# Altium project UCLA-DRS4.PrjPCB (part 9 of 10)

## Sheet DRS4_GPIO_EXPANDER.SchDoc: My title
size A3; Organization: University of California; Address1: 475 Portola Plaza; Address2: Los Angeles, CA 90095; DocumentNumber: 33; Revision: R01; SheetNumber: 33; SheetTotal: 35
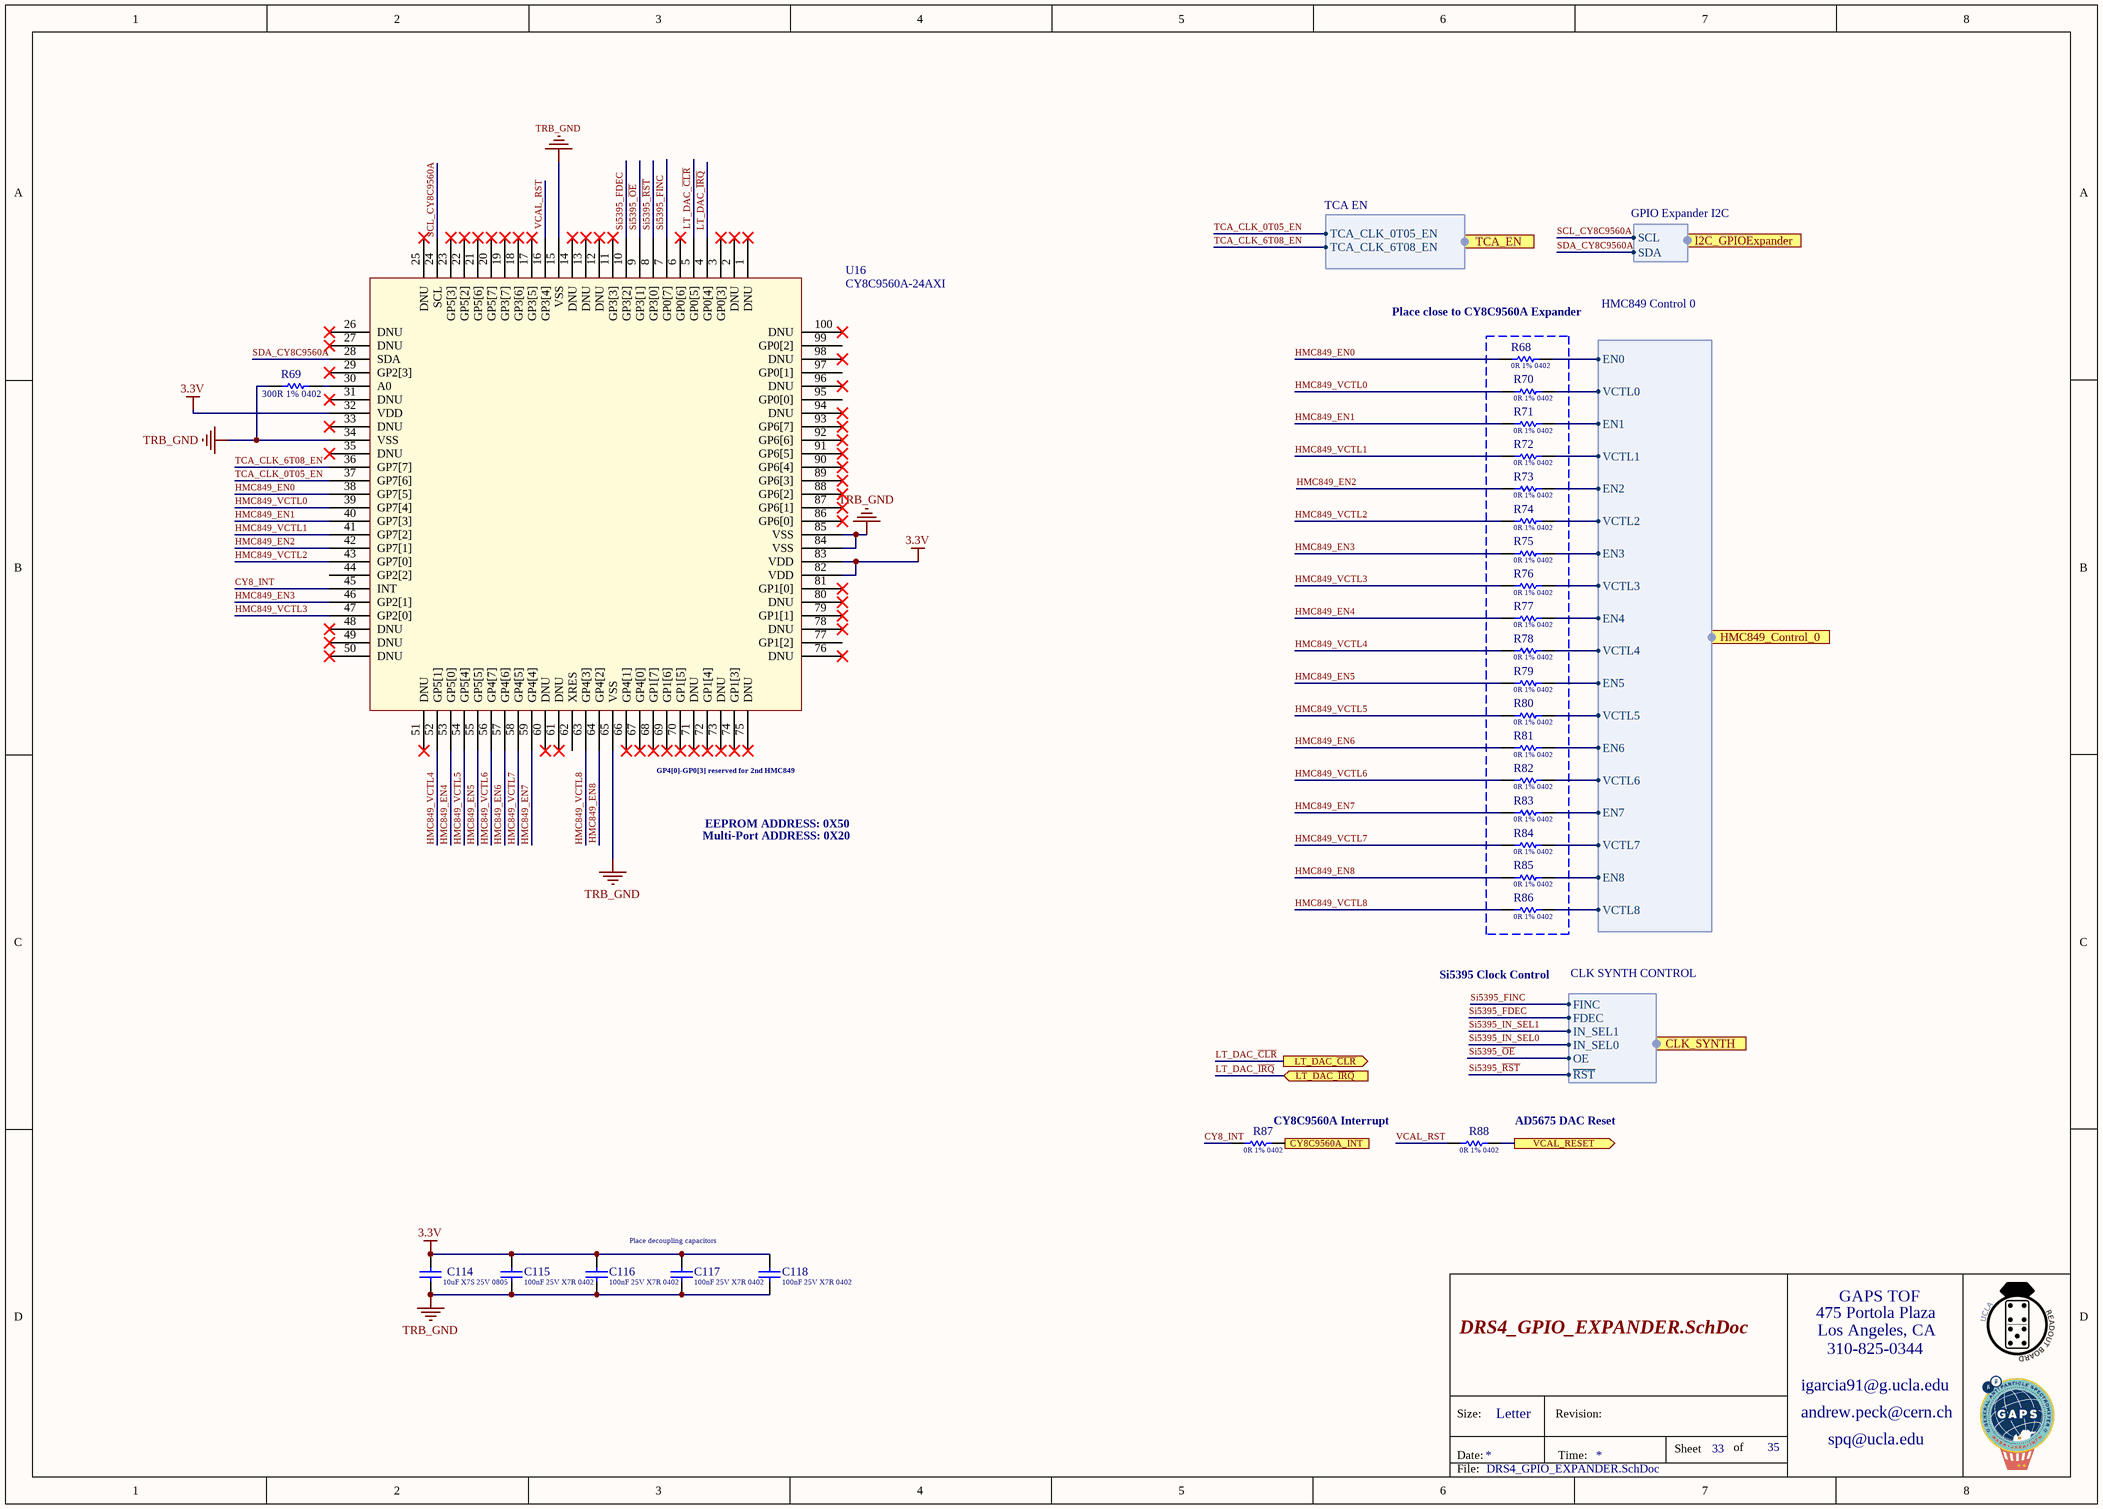
[diagram p27: DRS4_GPIO_EXPANDER.SchDoc]

### Parts
C114  Capacitance: 10uF X7S 25V 0805  [Cap_Murata_ GRM21BC71E106ME11L_10uF]  (hidden comment: Cap_Murata_ GRM21BC71E106ME11L_10uF)
C115  Capacitance: 100nF 25V X7R 0402  [Cap_Taiyo_Yuden_TMK105B7104KV-FR_100nF]  (hidden comment: Cap_Taiyo_Yuden_TMK105B7104KV-FR_100nF)
C116  Capacitance: 100nF 25V X7R 0402  [Cap_Taiyo_Yuden_TMK105B7104KV-FR_100nF]  (hidden comment: Cap_Taiyo_Yuden_TMK105B7104KV-FR_100nF)
C117  Capacitance: 100nF 25V X7R 0402  [Cap_Taiyo_Yuden_TMK105B7104KV-FR_100nF]  (hidden comment: Cap_Taiyo_Yuden_TMK105B7104KV-FR_100nF)
C118  Capacitance: 100nF 25V X7R 0402  [Cap_Taiyo_Yuden_TMK105B7104KV-FR_100nF]  (hidden comment: Cap_Taiyo_Yuden_TMK105B7104KV-FR_100nF)
R68  Resistance: 0R 1% 0402  [Res_Vishay_CRCW04020000Z0EDC_0_Ohm]  (hidden comment: Res_Vishay_CRCW04020000Z0EDC_0_Ohm)
R69  300R 1% 0402  [RESC0402(1005)_L]
R70  Resistance: 0R 1% 0402  [Res_Vishay_CRCW04020000Z0EDC_0_Ohm]  (hidden comment: Res_Vishay_CRCW04020000Z0EDC_0_Ohm)
R71  Resistance: 0R 1% 0402  [Res_Vishay_CRCW04020000Z0EDC_0_Ohm]  (hidden comment: Res_Vishay_CRCW04020000Z0EDC_0_Ohm)
R72  Resistance: 0R 1% 0402  [Res_Vishay_CRCW04020000Z0EDC_0_Ohm]  (hidden comment: Res_Vishay_CRCW04020000Z0EDC_0_Ohm)
R73  Resistance: 0R 1% 0402  [Res_Vishay_CRCW04020000Z0EDC_0_Ohm]  (hidden comment: Res_Vishay_CRCW04020000Z0EDC_0_Ohm)
R74  Resistance: 0R 1% 0402  [Res_Vishay_CRCW04020000Z0EDC_0_Ohm]  (hidden comment: Res_Vishay_CRCW04020000Z0EDC_0_Ohm)
R75  Resistance: 0R 1% 0402  [Res_Vishay_CRCW04020000Z0EDC_0_Ohm]  (hidden comment: Res_Vishay_CRCW04020000Z0EDC_0_Ohm)
R76  Resistance: 0R 1% 0402  [Res_Vishay_CRCW04020000Z0EDC_0_Ohm]  (hidden comment: Res_Vishay_CRCW04020000Z0EDC_0_Ohm)
R77  Resistance: 0R 1% 0402  [Res_Vishay_CRCW04020000Z0EDC_0_Ohm]  (hidden comment: Res_Vishay_CRCW04020000Z0EDC_0_Ohm)
R78  Resistance: 0R 1% 0402  [Res_Vishay_CRCW04020000Z0EDC_0_Ohm]  (hidden comment: Res_Vishay_CRCW04020000Z0EDC_0_Ohm)
R79  Resistance: 0R 1% 0402  [Res_Vishay_CRCW04020000Z0EDC_0_Ohm]  (hidden comment: Res_Vishay_CRCW04020000Z0EDC_0_Ohm)
R80  Resistance: 0R 1% 0402  [Res_Vishay_CRCW04020000Z0EDC_0_Ohm]  (hidden comment: Res_Vishay_CRCW04020000Z0EDC_0_Ohm)
R81  Resistance: 0R 1% 0402  [Res_Vishay_CRCW04020000Z0EDC_0_Ohm]  (hidden comment: Res_Vishay_CRCW04020000Z0EDC_0_Ohm)
R82  Resistance: 0R 1% 0402  [Res_Vishay_CRCW04020000Z0EDC_0_Ohm]  (hidden comment: Res_Vishay_CRCW04020000Z0EDC_0_Ohm)
R83  Resistance: 0R 1% 0402  [Res_Vishay_CRCW04020000Z0EDC_0_Ohm]  (hidden comment: Res_Vishay_CRCW04020000Z0EDC_0_Ohm)
R84  Resistance: 0R 1% 0402  [Res_Vishay_CRCW04020000Z0EDC_0_Ohm]  (hidden comment: Res_Vishay_CRCW04020000Z0EDC_0_Ohm)
R85  Resistance: 0R 1% 0402  [Res_Vishay_CRCW04020000Z0EDC_0_Ohm]  (hidden comment: Res_Vishay_CRCW04020000Z0EDC_0_Ohm)
R86  Resistance: 0R 1% 0402  [Res_Vishay_CRCW04020000Z0EDC_0_Ohm]  (hidden comment: Res_Vishay_CRCW04020000Z0EDC_0_Ohm)
R87  Resistance: 0R 1% 0402  [Res_Vishay_CRCW04020000Z0EDC_0_Ohm]  (hidden comment: Res_Vishay_CRCW04020000Z0EDC_0_Ohm)
R88  Resistance: 0R 1% 0402  [Res_Vishay_CRCW04020000Z0EDC_0_Ohm]  (hidden comment: Res_Vishay_CRCW04020000Z0EDC_0_Ohm)
U16  Series: CY8C9560A-24AXI  [IC_Cypress_Semiconductor_CY8C9560A-24AXI]  (hidden comment: IC_Cypress_Semiconductor_CY8C9560A-24AXI)

### Ports
CLK_SYNTH (harness CLK SYNTH CONTROL), CY8C9560A_INT (out), HMC849_Control_0 (harness HMC849 Control 0), I2C_GPIOExpander (harness GPIO Expander I2C), LT_DAC_~{CLR} (out), LT_DAC_~{IRQ} (in), TCA_EN (harness TCA EN), VCAL_RESET (out)

### Harnesses
HMC849 Control 0: EN0, VCTL0, EN1, VCTL1, EN2, VCTL2, EN3, VCTL3, EN4, VCTL4, EN5, VCTL5, EN6, VCTL6, EN7, VCTL7, EN8, VCTL8
GPIO Expander I2C: SCL, SDA
TCA EN: TCA_CLK_0T05_EN, TCA_CLK_6T08_EN
CLK SYNTH CONTROL: ~{RST}, OE, IN_SEL0, IN_SEL1, FDEC, FINC

### Nets
3.3V: C114.1 C115.2 C116.2 C117.2 C118.2 U16.32(VDD) U16.82(VDD) U16.83(VDD)
TRB_GND: C114.2 C115.1 C116.1 C117.1 C118.1 R69.2 U16.15(VSS) U16.34(VSS) U16.65(VSS) U16.84(VSS) U16.85(VSS)
CY8_INT: R87.2 U16.45(INT)
HMC849:EN0: R68.2 ; port HMC849_Control_0.EN0
HMC849:EN1: R71.2 ; port HMC849_Control_0.EN1
HMC849:EN2: R73.2 ; port HMC849_Control_0.EN2
HMC849:EN3: R75.2 ; port HMC849_Control_0.EN3
HMC849:EN4: R77.2 ; port HMC849_Control_0.EN4
HMC849:EN5: R79.2 ; port HMC849_Control_0.EN5
HMC849:EN6: R81.2 ; port HMC849_Control_0.EN6
HMC849:EN7: R83.2 ; port HMC849_Control_0.EN7
HMC849:EN8: R85.2 ; port HMC849_Control_0.EN8
HMC849:VCTL0: R70.2 ; port HMC849_Control_0.VCTL0
HMC849:VCTL1: R72.2 ; port HMC849_Control_0.VCTL1
HMC849:VCTL2: R74.2 ; port HMC849_Control_0.VCTL2
HMC849:VCTL3: R76.2 ; port HMC849_Control_0.VCTL3
HMC849:VCTL4: R78.2 ; port HMC849_Control_0.VCTL4
HMC849:VCTL5: R80.2 ; port HMC849_Control_0.VCTL5
HMC849:VCTL6: R82.2 ; port HMC849_Control_0.VCTL6
HMC849:VCTL7: R84.2 ; port HMC849_Control_0.VCTL7
HMC849:VCTL8: R86.2 ; port HMC849_Control_0.VCTL8
HMC849_EN0: R68.1 U16.38(GP7[5])
HMC849_EN1: R71.1 U16.40(GP7[3])
HMC849_EN2: R73.1 U16.42(GP7[1])
HMC849_EN3: R75.1 U16.46(GP2[1])
HMC849_EN4: R77.1 U16.53(GP5[0])
HMC849_EN5: R79.1 U16.55(GP5[5])
HMC849_EN6: R81.1 U16.57(GP4[6])
HMC849_EN7: R83.1 U16.59(GP4[4])
HMC849_EN8: R85.1 U16.64(GP4[2])
HMC849_VCTL0: R70.1 U16.39(GP7[4])
HMC849_VCTL1: R72.1 U16.41(GP7[2])
HMC849_VCTL2: R74.1 U16.43(GP7[0])
HMC849_VCTL3: R76.1 U16.47(GP2[0])
HMC849_VCTL4: R78.1 U16.52(GP5[1])
HMC849_VCTL5: R80.1 U16.54(GP5[4])
HMC849_VCTL6: R82.1 U16.56(GP4[7])
HMC849_VCTL7: R84.1 U16.58(GP4[5])
HMC849_VCTL8: R86.1 U16.63(GP4[3])
IO_B35_L15_AD12_F20_N: R87.1 ; port CY8C9560A_INT
LT_DAC_~{CLR}: U16.5(GP0[5]) ; port LT_DAC_~{CLR}  [project net DAC_~{CLR}]
LT_DAC_~{IRQ}: U16.4(GP0[4]) ; port LT_DAC_~{IRQ}  [project net DAC_~{IRQ}]
SCL_CY8C9560A: U16.24(SCL) ; port I2C_GPIOExpander.SCL
SDA_CY8C9560A: U16.28(SDA) ; port I2C_GPIOExpander.SDA
Si5395_FDEC: U16.10(GP3[2]) ; port CLK_SYNTH.FDEC
Si5395_FINC: U16.7(GP0[7]) ; port CLK_SYNTH.FINC
Si5395_IN_SEL0: port CLK_SYNTH.IN_SEL0
Si5395_IN_SEL1: port CLK_SYNTH.IN_SEL1
Si5395_~{OE}: U16.9(GP3[1]) ; port CLK_SYNTH.OE
Si5395_~{RST}: U16.8(GP3[0]) ; port CLK_SYNTH.~{RST}
TCA_CLK_0T05_EN: U16.37(GP7[6]) ; port TCA_EN.TCA_CLK_0T05_EN
TCA_CLK_6T08_EN: U16.36(GP7[7]) ; port TCA_EN.TCA_CLK_6T08_EN
VCAL_RESET: R88.1 ; port VCAL_RESET
VCAL_RST: R88.2 U16.16(GP3[4])
NetR69_1: R69.1 U16.30(A0)

Not connected (* = marked no-connect by the designer): U16 1(DNU)* 2(DNU)* 3(GP0[3])* 6(GP0[6])* 11(GP3[3])* 12(DNU)* 13(DNU)* 14(DNU)* 17(GP3[5])* 18(GP3[6])* 19(GP3[7])* 20(GP5[7])* 21(GP5[6])* 22(GP5[2])* 23(GP5[3])* 25(DNU)* 26(DNU)* 27(DNU)* 29(GP2[3])* 31(DNU)* 33(DNU)* 35(DNU)* 44(GP2[2]) 48(DNU)* 49(DNU)* 50(DNU)* 51(DNU)* 60(DNU)* 61(DNU)* 62(XRES) 66(GP4[1])* 67(GP4[0])* 68(GP1[7])* 69(GP1[6])* 70(GP1[5])* 71(DNU)* 72(GP1[4])* 73(DNU)* 74(GP1[3])* 75(DNU)* 76(DNU)* 77(GP1[2]) 78(DNU)* 79(GP1[1])* 80(DNU)* 81(GP1[0])* 86(GP6[0])* 87(GP6[1])* 88(GP6[2])* 89(GP6[3])* 90(GP6[4])* 91(GP6[5])* 92(GP6[6])* 93(GP6[7])* 94(DNU)* 95(GP0[0]) 96(DNU)* 97(GP0[1]) 98(DNU)* 99(GP0[2]) 100(DNU)*

### Notes on the sheet
- (near R68) Place close to CY8C9560A Expander
- GP4[0]-GP0[3] reserved for 2nd HMC849
- Multi-Port ADDRESS: 0X20
- EEPROM ADDRESS: 0X50
- Si5395 Clock Control
- (near R87) CY8C9560A Interrupt
- (near R88) AD5675 DAC Reset
- (near C117) Place decoupling capacitors
- 475 Portola Plaza
- GAPS TOF
- igarcia91@g.ucla.edu
- Los Angeles, CA
- 310-825-0344
- Size:
- Date:
- Letter
- Revision:
- Time:
- Sheet
- of
- andrew.peck@cern.ch
- spq@ucla.edu
- File:

### Library data of the parts
C114 = Cap_Murata_ GRM21BC71E106ME11L_10uF: CAP CER 10uF 25V X7R 0805; Supplier 1: Mouser; Supplier Part Number 1: 81-GRM21BC71E106ME1L
C115-C118 = Cap_Taiyo_Yuden_TMK105B7104KV-FR_100nF: CAP CER 100nF 25V X7R 0402; Supplier 1: Mouser; Supplier Part Number 1: 963-TMK105B7104KV-FR
R68 R70-R88 = Res_Vishay_CRCW04020000Z0EDC_0_Ohm: 0R 0.062W 1% 0402 (1005 Metric)  SMD; Supplier 1: Mouser; Supplier Part Number 1: 71-CRCW04020000Z0EDC
R69 = CMP-1011-00449-1: 300R 0.063W 1% 0402 (1005 Metric)  SMD; Case-EIA: 0402; Value: 300.00 Ohm; Case-Metric: 1005; Tolerance: 1 %; Technology: SMT; Power: 0.063 W
U16 = IC_Cypress_Semiconductor_CY8C9560A-24AXI: Interface - I/O Expanders 60BIT IO EXPANDER W/EEPROM; Supplier 1: Mouser; Supplier Part Number 1: 727-CY8C9560A-24AXI

## Sheet GPIO_EXPANDER_LED.SchDoc: My title
size A3; Organization: University of California; Address1: 475 Portola Plaza; Address2: Los Angeles, CA 90095; DocumentNumber: 32; Revision: R01; SheetNumber: 32; SheetTotal: 35
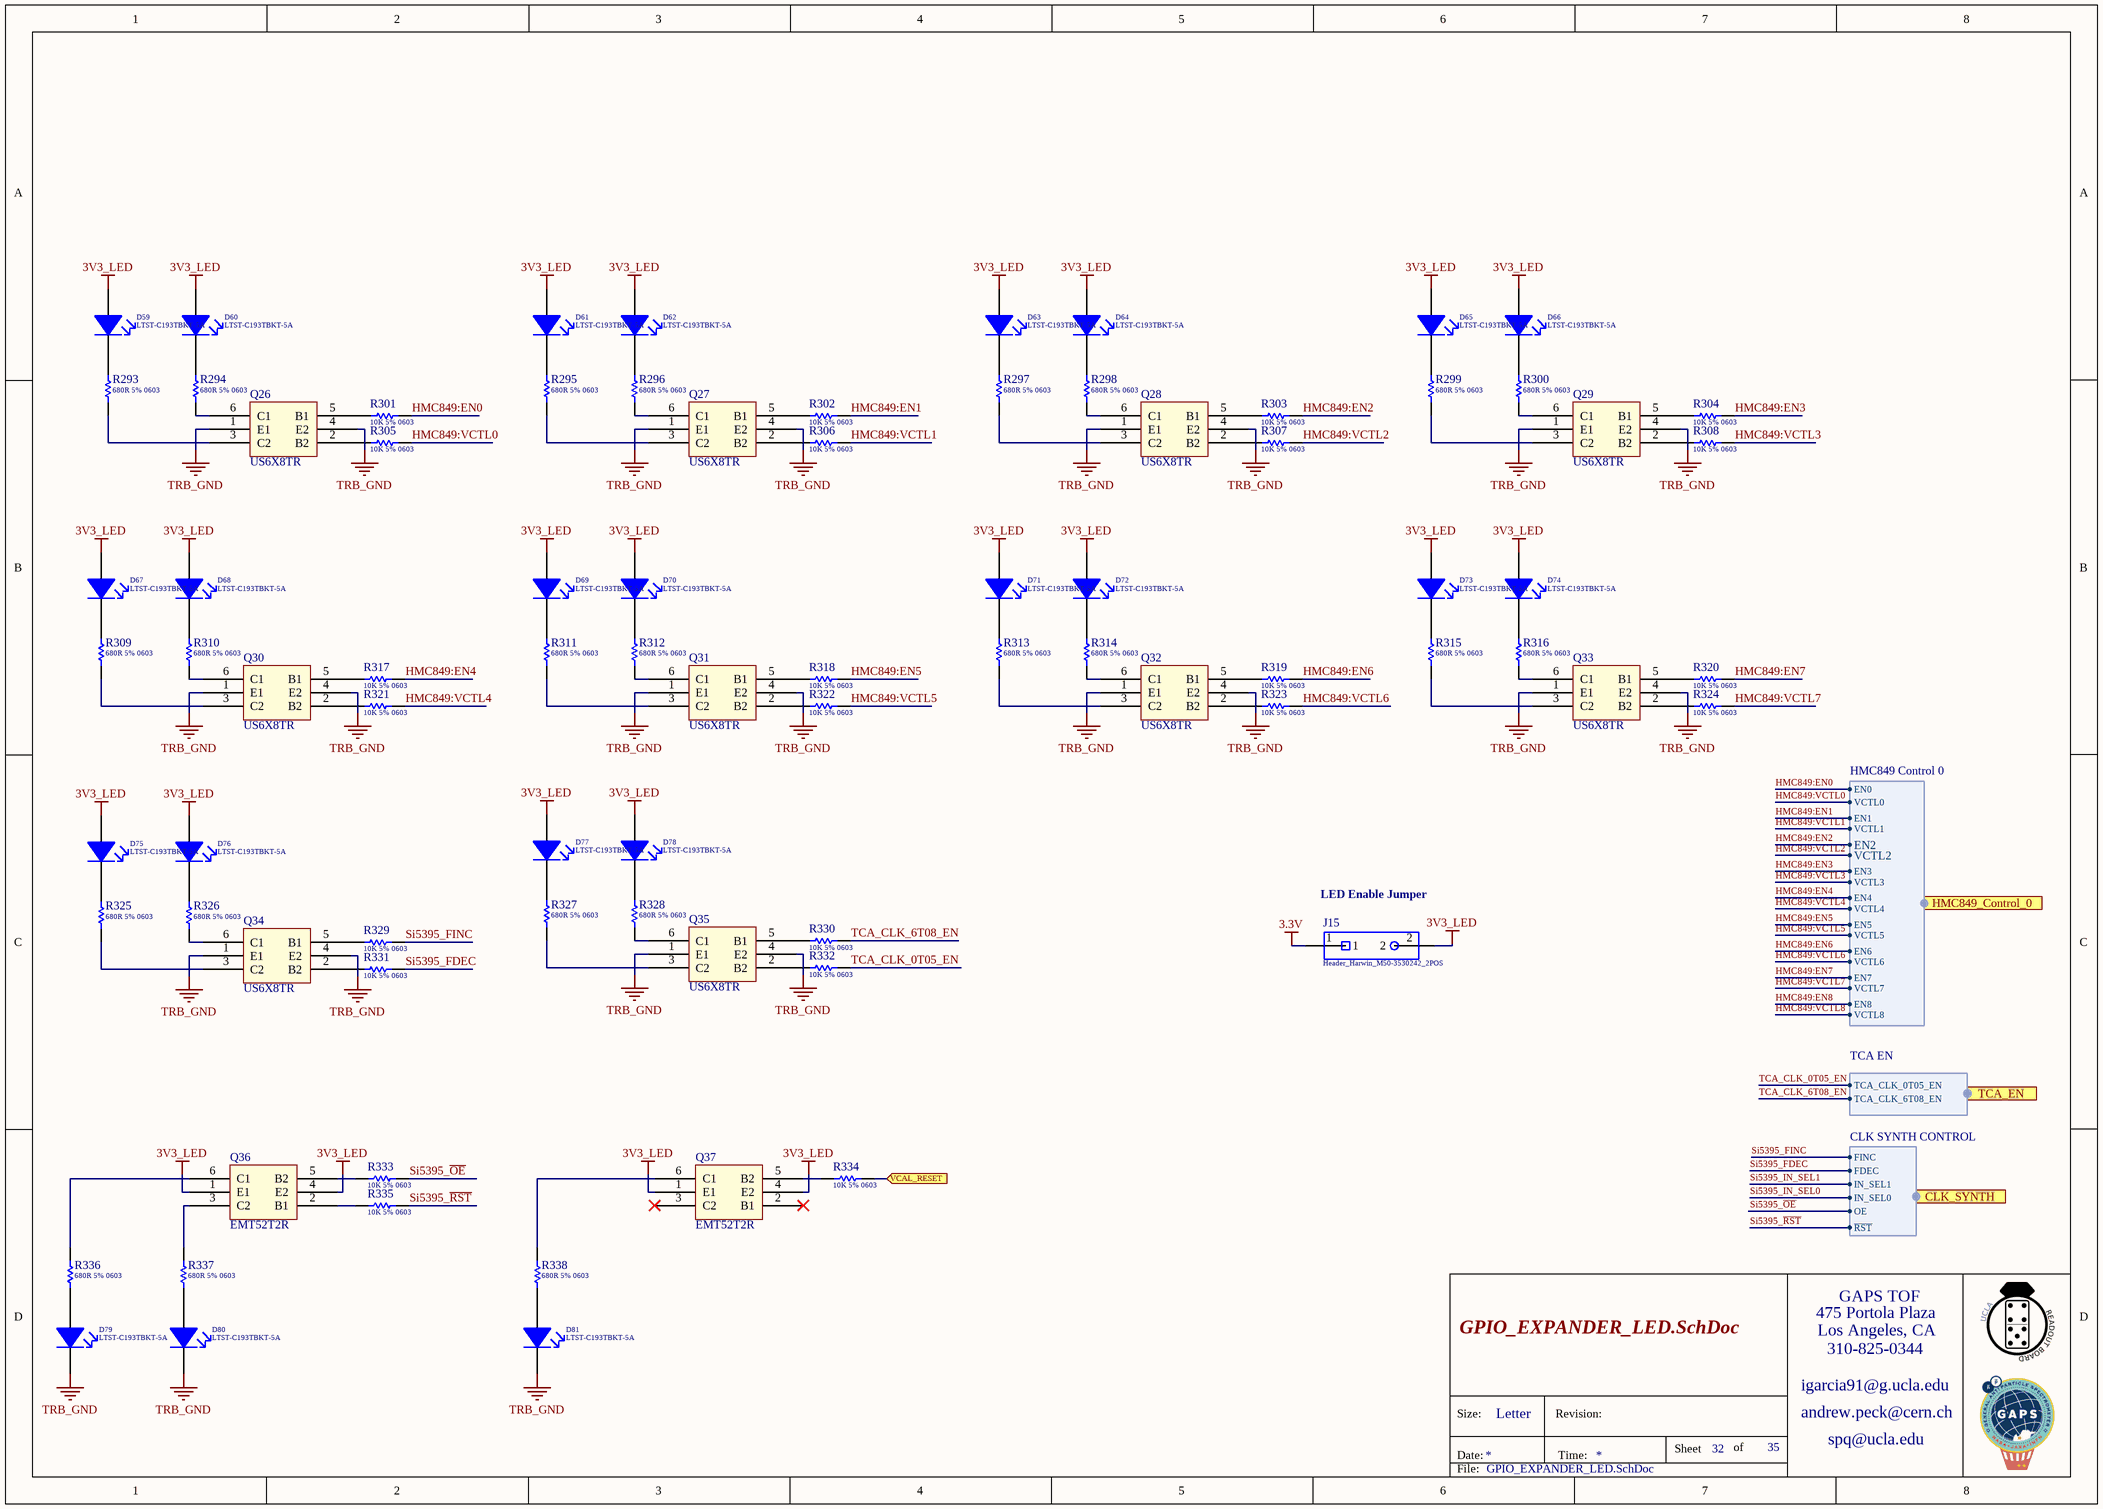
[diagram p28: GPIO_EXPANDER_LED.SchDoc]

### Parts
D59  Series: LTST-C193TBKT-5A  [Led_Lite-On_LTST-C193TBKT-5A_Blue]  (hidden comment: Led_Lite-On_LTST-C193TBKT-5A_Blue)
D60  Series: LTST-C193TBKT-5A  [Led_Lite-On_LTST-C193TBKT-5A_Blue]  (hidden comment: Led_Lite-On_LTST-C193TBKT-5A_Blue)
D61  Series: LTST-C193TBKT-5A  [Led_Lite-On_LTST-C193TBKT-5A_Blue]  (hidden comment: Led_Lite-On_LTST-C193TBKT-5A_Blue)
D62  Series: LTST-C193TBKT-5A  [Led_Lite-On_LTST-C193TBKT-5A_Blue]  (hidden comment: Led_Lite-On_LTST-C193TBKT-5A_Blue)
D63  Series: LTST-C193TBKT-5A  [Led_Lite-On_LTST-C193TBKT-5A_Blue]  (hidden comment: Led_Lite-On_LTST-C193TBKT-5A_Blue)
D64  Series: LTST-C193TBKT-5A  [Led_Lite-On_LTST-C193TBKT-5A_Blue]  (hidden comment: Led_Lite-On_LTST-C193TBKT-5A_Blue)
D65  Series: LTST-C193TBKT-5A  [Led_Lite-On_LTST-C193TBKT-5A_Blue]  (hidden comment: Led_Lite-On_LTST-C193TBKT-5A_Blue)
D66  Series: LTST-C193TBKT-5A  [Led_Lite-On_LTST-C193TBKT-5A_Blue]  (hidden comment: Led_Lite-On_LTST-C193TBKT-5A_Blue)
D67  Series: LTST-C193TBKT-5A  [Led_Lite-On_LTST-C193TBKT-5A_Blue]  (hidden comment: Led_Lite-On_LTST-C193TBKT-5A_Blue)
D68  Series: LTST-C193TBKT-5A  [Led_Lite-On_LTST-C193TBKT-5A_Blue]  (hidden comment: Led_Lite-On_LTST-C193TBKT-5A_Blue)
D69  Series: LTST-C193TBKT-5A  [Led_Lite-On_LTST-C193TBKT-5A_Blue]  (hidden comment: Led_Lite-On_LTST-C193TBKT-5A_Blue)
D70  Series: LTST-C193TBKT-5A  [Led_Lite-On_LTST-C193TBKT-5A_Blue]  (hidden comment: Led_Lite-On_LTST-C193TBKT-5A_Blue)
D71  Series: LTST-C193TBKT-5A  [Led_Lite-On_LTST-C193TBKT-5A_Blue]  (hidden comment: Led_Lite-On_LTST-C193TBKT-5A_Blue)
D72  Series: LTST-C193TBKT-5A  [Led_Lite-On_LTST-C193TBKT-5A_Blue]  (hidden comment: Led_Lite-On_LTST-C193TBKT-5A_Blue)
D73  Series: LTST-C193TBKT-5A  [Led_Lite-On_LTST-C193TBKT-5A_Blue]  (hidden comment: Led_Lite-On_LTST-C193TBKT-5A_Blue)
D74  Series: LTST-C193TBKT-5A  [Led_Lite-On_LTST-C193TBKT-5A_Blue]  (hidden comment: Led_Lite-On_LTST-C193TBKT-5A_Blue)
D75  Series: LTST-C193TBKT-5A  [Led_Lite-On_LTST-C193TBKT-5A_Blue]  (hidden comment: Led_Lite-On_LTST-C193TBKT-5A_Blue)
D76  Series: LTST-C193TBKT-5A  [Led_Lite-On_LTST-C193TBKT-5A_Blue]  (hidden comment: Led_Lite-On_LTST-C193TBKT-5A_Blue)
D77  Series: LTST-C193TBKT-5A  [Led_Lite-On_LTST-C193TBKT-5A_Blue]  (hidden comment: Led_Lite-On_LTST-C193TBKT-5A_Blue)
D78  Series: LTST-C193TBKT-5A  [Led_Lite-On_LTST-C193TBKT-5A_Blue]  (hidden comment: Led_Lite-On_LTST-C193TBKT-5A_Blue)
D79  Series: LTST-C193TBKT-5A  [Led_Lite-On_LTST-C193TBKT-5A_Blue]  (hidden comment: Led_Lite-On_LTST-C193TBKT-5A_Blue)
D80  Series: LTST-C193TBKT-5A  [Led_Lite-On_LTST-C193TBKT-5A_Blue]  (hidden comment: Led_Lite-On_LTST-C193TBKT-5A_Blue)
D81  Series: LTST-C193TBKT-5A  [Led_Lite-On_LTST-C193TBKT-5A_Blue]  (hidden comment: Led_Lite-On_LTST-C193TBKT-5A_Blue)
J15  Header_Harwin_M50-3530242_2POS  [Header_Harwin_M50-3530242_2POS]
Q26  Series: US6X8TR  [BJT_ROHM_US6X8TR_1A_NPN]  (hidden comment: BJT_ROHM_US6X8TR_1A_NPN)
Q27  Series: US6X8TR  [BJT_ROHM_US6X8TR_1A_NPN]  (hidden comment: BJT_ROHM_US6X8TR_1A_NPN)
Q28  Series: US6X8TR  [BJT_ROHM_US6X8TR_1A_NPN]  (hidden comment: BJT_ROHM_US6X8TR_1A_NPN)
Q29  Series: US6X8TR  [BJT_ROHM_US6X8TR_1A_NPN]  (hidden comment: BJT_ROHM_US6X8TR_1A_NPN)
Q30  Series: US6X8TR  [BJT_ROHM_US6X8TR_1A_NPN]  (hidden comment: BJT_ROHM_US6X8TR_1A_NPN)
Q31  Series: US6X8TR  [BJT_ROHM_US6X8TR_1A_NPN]  (hidden comment: BJT_ROHM_US6X8TR_1A_NPN)
Q32  Series: US6X8TR  [BJT_ROHM_US6X8TR_1A_NPN]  (hidden comment: BJT_ROHM_US6X8TR_1A_NPN)
Q33  Series: US6X8TR  [BJT_ROHM_US6X8TR_1A_NPN]  (hidden comment: BJT_ROHM_US6X8TR_1A_NPN)
Q34  Series: US6X8TR  [BJT_ROHM_US6X8TR_1A_NPN]  (hidden comment: BJT_ROHM_US6X8TR_1A_NPN)
Q35  Series: US6X8TR  [BJT_ROHM_US6X8TR_1A_NPN]  (hidden comment: BJT_ROHM_US6X8TR_1A_NPN)
Q36  Series: EMT52T2R  [BJT_ROHM_EMT52T2R_100mA_PNP]  (hidden comment: BJT_ROHM_EMT52T2R_100mA_PNP)
Q37  Series: EMT52T2R  [BJT_ROHM_EMT52T2R_100mA_PNP]  (hidden comment: BJT_ROHM_EMT52T2R_100mA_PNP)
R293  680R 5% 0603  [RESC0603(1608)_L]
R294  680R 5% 0603  [RESC0603(1608)_L]
R295  680R 5% 0603  [RESC0603(1608)_L]
R296  680R 5% 0603  [RESC0603(1608)_L]
R297  680R 5% 0603  [RESC0603(1608)_L]
R298  680R 5% 0603  [RESC0603(1608)_L]
R299  680R 5% 0603  [RESC0603(1608)_L]
R300  680R 5% 0603  [RESC0603(1608)_L]
R301  10K 5% 0603  [RESC0603(1608)_L]
R302  10K 5% 0603  [RESC0603(1608)_L]
R303  10K 5% 0603  [RESC0603(1608)_L]
R304  10K 5% 0603  [RESC0603(1608)_L]
R305  10K 5% 0603  [RESC0603(1608)_L]
R306  10K 5% 0603  [RESC0603(1608)_L]
R307  10K 5% 0603  [RESC0603(1608)_L]
R308  10K 5% 0603  [RESC0603(1608)_L]
R309  680R 5% 0603  [RESC0603(1608)_L]
R310  680R 5% 0603  [RESC0603(1608)_L]
R311  680R 5% 0603  [RESC0603(1608)_L]
R312  680R 5% 0603  [RESC0603(1608)_L]
R313  680R 5% 0603  [RESC0603(1608)_L]
R314  680R 5% 0603  [RESC0603(1608)_L]
R315  680R 5% 0603  [RESC0603(1608)_L]
R316  680R 5% 0603  [RESC0603(1608)_L]
R317  10K 5% 0603  [RESC0603(1608)_L]
R318  10K 5% 0603  [RESC0603(1608)_L]
R319  10K 5% 0603  [RESC0603(1608)_L]
R320  10K 5% 0603  [RESC0603(1608)_L]
R321  10K 5% 0603  [RESC0603(1608)_L]
R322  10K 5% 0603  [RESC0603(1608)_L]
R323  10K 5% 0603  [RESC0603(1608)_L]
R324  10K 5% 0603  [RESC0603(1608)_L]
R325  680R 5% 0603  [RESC0603(1608)_L]
R326  680R 5% 0603  [RESC0603(1608)_L]
R327  680R 5% 0603  [RESC0603(1608)_L]
R328  680R 5% 0603  [RESC0603(1608)_L]
R329  10K 5% 0603  [RESC0603(1608)_L]
R330  10K 5% 0603  [RESC0603(1608)_L]
R331  10K 5% 0603  [RESC0603(1608)_L]
R332  10K 5% 0603  [RESC0603(1608)_L]
R333  10K 5% 0603  [RESC0603(1608)_L]
R334  10K 5% 0603  [RESC0603(1608)_L]
R335  10K 5% 0603  [RESC0603(1608)_L]
R336  680R 5% 0603  [RESC0603(1608)_L]
R337  680R 5% 0603  [RESC0603(1608)_L]
R338  680R 5% 0603  [RESC0603(1608)_L]

### Ports
CLK_SYNTH (harness CLK SYNTH CONTROL), HMC849_Control_0 (harness HMC849 Control 0), TCA_EN (harness TCA EN), VCAL_RESET (in)

### Harnesses
HMC849 Control 0: EN0, VCTL0, EN1, VCTL1, EN2, VCTL2, EN3, VCTL3, EN4, VCTL4, EN5, VCTL5, EN6, VCTL6, EN7, VCTL7, EN8, VCTL8
TCA EN: TCA_CLK_0T05_EN, TCA_CLK_6T08_EN
CLK SYNTH CONTROL: ~{RST}, OE, IN_SEL0, IN_SEL1, FDEC, FINC

### Nets
3.3V: J15.1
3V3_LED: D59.2(A) D60.2(A) D61.2(A) D62.2(A) D63.2(A) D64.2(A) D65.2(A) D66.2(A) D67.2(A) D68.2(A) D69.2(A) D70.2(A) D71.2(A) D72.2(A) D73.2(A) D74.2(A) D75.2(A) D76.2(A) D77.2(A) D78.2(A) J15.2 Q36.1(E1) Q36.4(E2) Q37.1(E1) Q37.4(E2)
TRB_GND: D79.1(K) D80.1(K) D81.1(K) Q26.1(E1) Q26.4(E2) Q27.1(E1) Q27.4(E2) Q28.1(E1) Q28.4(E2) Q29.1(E1) Q29.4(E2) Q30.1(E1) Q30.4(E2) Q31.1(E1) Q31.4(E2) Q32.1(E1) Q32.4(E2) Q33.1(E1) Q33.4(E2) Q34.1(E1) Q34.4(E2) Q35.1(E1) Q35.4(E2)
HMC849:EN0: R301.2 ; port HMC849_Control_0.EN0
HMC849:EN1: R302.2 ; port HMC849_Control_0.EN1
HMC849:EN2: R303.2 ; port HMC849_Control_0.EN2
HMC849:EN3: R304.2 ; port HMC849_Control_0.EN3
HMC849:EN4: R317.2 ; port HMC849_Control_0.EN4
HMC849:EN5: R318.2 ; port HMC849_Control_0.EN5
HMC849:EN6: R319.2 ; port HMC849_Control_0.EN6
HMC849:EN7: R320.2 ; port HMC849_Control_0.EN7
HMC849:VCTL0: R305.1 ; port HMC849_Control_0.VCTL0
HMC849:VCTL1: R306.1 ; port HMC849_Control_0.VCTL1
HMC849:VCTL2: R307.1 ; port HMC849_Control_0.VCTL2
HMC849:VCTL3: R308.1 ; port HMC849_Control_0.VCTL3
HMC849:VCTL4: R321.1 ; port HMC849_Control_0.VCTL4
HMC849:VCTL5: R322.1 ; port HMC849_Control_0.VCTL5
HMC849:VCTL6: R323.1 ; port HMC849_Control_0.VCTL6
HMC849:VCTL7: R324.1 ; port HMC849_Control_0.VCTL7
Si5395_FDEC: R331.1 ; port CLK_SYNTH.FDEC
Si5395_FINC: R329.2 ; port CLK_SYNTH.FINC
Si5395_IN_SEL0: port CLK_SYNTH.IN_SEL0
Si5395_IN_SEL1: port CLK_SYNTH.IN_SEL1
Si5395_~{OE}: R333.1 ; port CLK_SYNTH.OE
Si5395_~{RST}: R335.2 ; port CLK_SYNTH.~{RST}
TCA_CLK_0T05_EN: R332.1 ; port TCA_EN.TCA_CLK_0T05_EN
TCA_CLK_6T08_EN: R330.2 ; port TCA_EN.TCA_CLK_6T08_EN
VCAL_RESET: R334.1 ; port VCAL_RESET
NetD59_1: D59.1(K) R293.2
NetD60_1: D60.1(K) R294.2
NetD61_1: D61.1(K) R295.2
NetD62_1: D62.1(K) R296.2
NetD63_1: D63.1(K) R297.2
NetD64_1: D64.1(K) R298.2
NetD65_1: D65.1(K) R299.2
NetD66_1: D66.1(K) R300.2
NetD67_1: D67.1(K) R309.2
NetD68_1: D68.1(K) R310.2
NetD69_1: D69.1(K) R311.2
NetD70_1: D70.1(K) R312.2
NetD71_1: D71.1(K) R313.2
NetD72_1: D72.1(K) R314.2
NetD73_1: D73.1(K) R315.2
NetD74_1: D74.1(K) R316.2
NetD75_1: D75.1(K) R325.2
NetD76_1: D76.1(K) R326.2
NetD77_1: D77.1(K) R327.2
NetD78_1: D78.1(K) R328.2
NetD79_2: D79.2(A) R336.1
NetD80_2: D80.2(A) R337.1
NetD81_2: D81.2(A) R338.1
NetQ26_2: Q26.2(B2) R305.2
NetQ26_3: Q26.3(C2) R293.1
NetQ26_5: Q26.5(B1) R301.1
NetQ26_6: Q26.6(C1) R294.1
NetQ27_2: Q27.2(B2) R306.2
NetQ27_3: Q27.3(C2) R295.1
NetQ27_5: Q27.5(B1) R302.1
NetQ27_6: Q27.6(C1) R296.1
NetQ28_2: Q28.2(B2) R307.2
NetQ28_3: Q28.3(C2) R297.1
NetQ28_5: Q28.5(B1) R303.1
NetQ28_6: Q28.6(C1) R298.1
NetQ29_2: Q29.2(B2) R308.2
NetQ29_3: Q29.3(C2) R299.1
NetQ29_5: Q29.5(B1) R304.1
NetQ29_6: Q29.6(C1) R300.1
NetQ30_2: Q30.2(B2) R321.2
NetQ30_3: Q30.3(C2) R309.1
NetQ30_5: Q30.5(B1) R317.1
NetQ30_6: Q30.6(C1) R310.1
NetQ31_2: Q31.2(B2) R322.2
NetQ31_3: Q31.3(C2) R311.1
NetQ31_5: Q31.5(B1) R318.1
NetQ31_6: Q31.6(C1) R312.1
NetQ32_2: Q32.2(B2) R323.2
NetQ32_3: Q32.3(C2) R313.1
NetQ32_5: Q32.5(B1) R319.1
NetQ32_6: Q32.6(C1) R314.1
NetQ33_2: Q33.2(B2) R324.2
NetQ33_3: Q33.3(C2) R315.1
NetQ33_5: Q33.5(B1) R320.1
NetQ33_6: Q33.6(C1) R316.1
NetQ34_2: Q34.2(B2) R331.2
NetQ34_3: Q34.3(C2) R325.1
NetQ34_5: Q34.5(B1) R329.1
NetQ34_6: Q34.6(C1) R326.1
NetQ35_2: Q35.2(B2) R332.2
NetQ35_3: Q35.3(C2) R327.1
NetQ35_5: Q35.5(B1) R330.1
NetQ35_6: Q35.6(C1) R328.1
NetQ36_2: Q36.2(B1) R335.1
NetQ36_3: Q36.3(C2) R337.2
NetQ36_5: Q36.5(B2) R333.2
NetQ36_6: Q36.6(C1) R336.2
NetQ37_5: Q37.5(B2) R334.2
NetQ37_6: Q37.6(C1) R338.2

Not connected (* = marked no-connect by the designer): Q37 2(B1)* 3(C2)*

### Notes on the sheet
- (near J15) LED Enable Jumper
- 475 Portola Plaza
- GAPS TOF
- igarcia91@g.ucla.edu
- Los Angeles, CA
- 310-825-0344
- Size:
- Date:
- Letter
- Revision:
- Time:
- Sheet
- of
- andrew.peck@cern.ch
- spq@ucla.edu
- File:

### Library data of the parts
D59-D81 = Led_Lite-On_LTST-C193TBKT-5A_Blue: Standard LEDs - SMD Blue 470nm 28mcd 20mA; Supplier 1: Mouser; Supplier Part Number 1: 859-LTSTC193TBKT5A
J15 = Header_Harwin_M50-3530242_2POS: Headers & Wire Housings 2 WAY SIL VERT PC TAIL P/HDR; Supplier 1: Mouser; Supplier Part Number 1: 855-M50-3530242
Q26-Q35 = BJT_ROHM_US6X8TR_1A_NPN: Bipolar Transistors - BJT NPN+NPN 30VCEO 1A SOT-363T; Manufacturer 1: ROHM; Supplier Part Number 1: 755-US6X8TR; Supplier 1: Mouser; Manufacturer Part Number 1: US6X8TR
Q36 Q37 = BJT_ROHM_EMT52T2R_100mA_PNP: Bipolar Transistors - BJT Bipolar Transistor SOT-563 SC-107C EMT6; Manufacturer 1: ROHM; Supplier 1: Mouser; Supplier Part Number 1: 755-EMT52T2R; Manufacturer Part Number 1: EMT52T2R
R293-R300 R309-R316 R325-R328 R336-R338 = CMP-1012-00070-1: 680R 0.1W 5% 0603 (1608 Metric)  SMD; Case-EIA: 0603; Value: 680.00 Ohm; Case-Metric: 1608; Tolerance: 5 %; Technology: SMT; Power: 0.1 W
R301-R308 R317-R324 R329-R335 = CMP-1012-00098-1: 10K 0.1W 5% 0603 (1608 Metric)  SMD; Case-EIA: 0603; Value: 10000.00 Ohm; Case-Metric: 1608; Technology: SMT; Tolerance: 5 %; Power: 0.1 W

## Sheet I2C_HEADER.SchDoc: My title
size A3; Organization: University of California; Address1: 475 Portola Plaza; Address2: Los Angeles, CA 90095; DocumentNumber: 31; Revision: R01; SheetNumber: 31; SheetTotal: 35
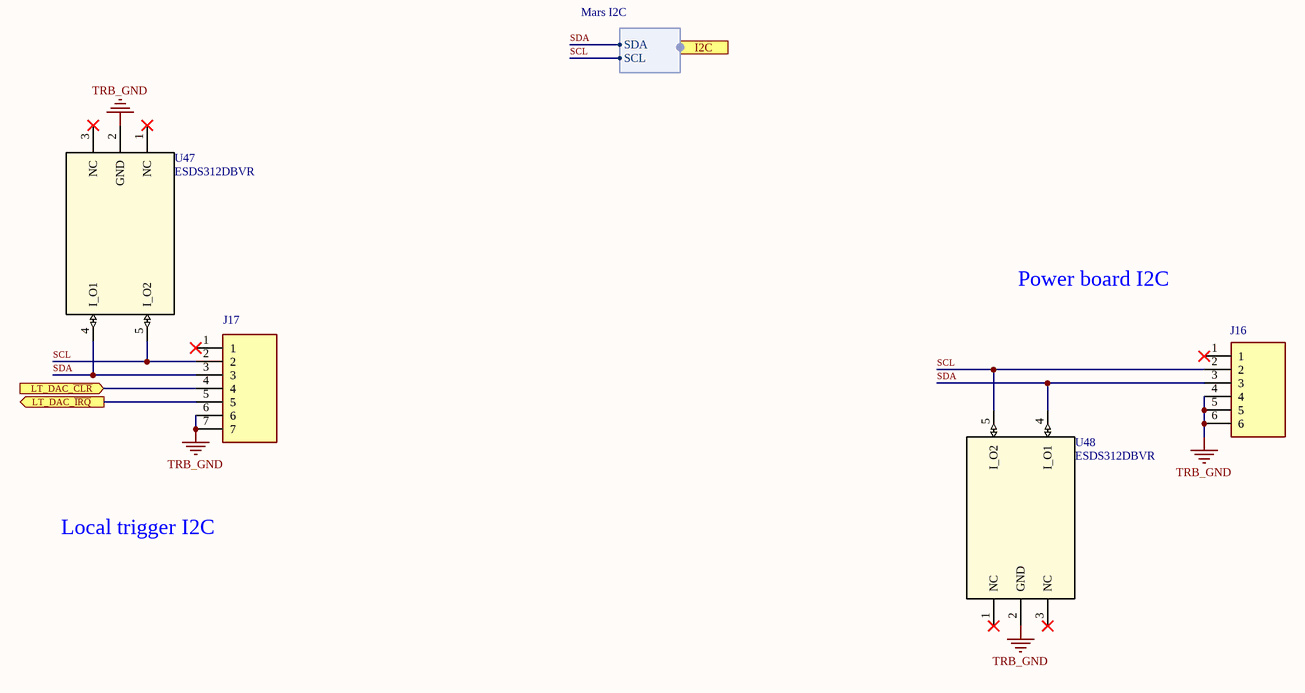
[diagram p29: I2C_HEADER.SchDoc]

### Parts
J16  61300611121  [HDRV6W64P0X254_1X6_1524X254X869P]  (value not drawn)
J17  61300711121  [HDRV7W64P0X254_1X7_1778X254X869P]  (value not drawn)
U47  ESDS312DBVR  [DBV0005A_L]
U48  ESDS312DBVR  [DBV0005A_L]

### Ports
I2C (harness Mars I2C), LT_DAC_~{CLR} (in), LT_DAC_~{IRQ} (out)

### Harnesses
Mars I2C: SCL, SDA

### Nets
TRB_GND: J16.4 J16.5 J16.6 J17.6 J17.7 U47.2(GND) U48.2(GND)
DAC_~{CLR}: J17.4 ; port LT_DAC_~{CLR}
DAC_~{IRQ}: J17.5 ; port LT_DAC_~{IRQ}
SCL: J16.2 J17.2 U47.5(I_O2) U48.5(I_O2) ; port I2C.SCL
SDA: J16.3 J17.3 U47.4(I_O1) U48.4(I_O1) ; port I2C.SDA

Not connected (* = marked no-connect by the designer): J16 1*; J17 1*; U47 1(NC)* 3(NC)*; U48 1(NC)* 3(NC)*

### Notes on the sheet
- Power board I2C
- Local trigger I2C
- 475 Portola Plaza
- GAPS TOF
- igarcia91@g.ucla.edu
- Los Angeles, CA
- 310-825-0344
- Size:
- Date:
- Letter
- Revision:
- Time:
- Sheet
- of
- andrew.peck@cern.ch
- spq@ucla.edu
- File:

### Library data of the parts
J16 = 61300611121: Connector; Manufacturer_Name: Wurth Elektronik; Datasheet Link: https://componentsearchengine.com//61300611121.pdf; Height: 8.69mm; Mouser2 Part Number: 710-61300611121; Mouser2 Price/Stock: https://www.mouser.com/Search/Refine.aspx?Keyword=710-61300611121; Manufacturer_Part_Number: 61300611121
J17 = 61300711121: Connector; Manufacturer_Name: Wurth Elektronik; Datasheet Link: https://componentsearchengine.com//61300711121.pdf; Height: 8.69mm; Mouser2 Part Number: 710-61300711121; Mouser2 Price/Stock: https://www.mouser.com/Search/Refine.aspx?Keyword=710-61300711121; Manufacturer_Part_Number: 61300711121
U47 U48 = ESDS312DBVR: 3.6V Data-Line Surge and 30kV ESD Protection Diode; Manufacturer: Texas Instruments; PartNumber: ESDS312DBVR; RefDes: RefDes; Type: DEV; Value: Value

## Sheet I2C_MULTIPLEX.SchDoc: My title
size A3; Organization: University of California; Address1: 475 Portola Plaza; Address2: Los Angeles, CA 90095; DocumentNumber: 34; Revision: R01; SheetNumber: 34; SheetTotal: 35
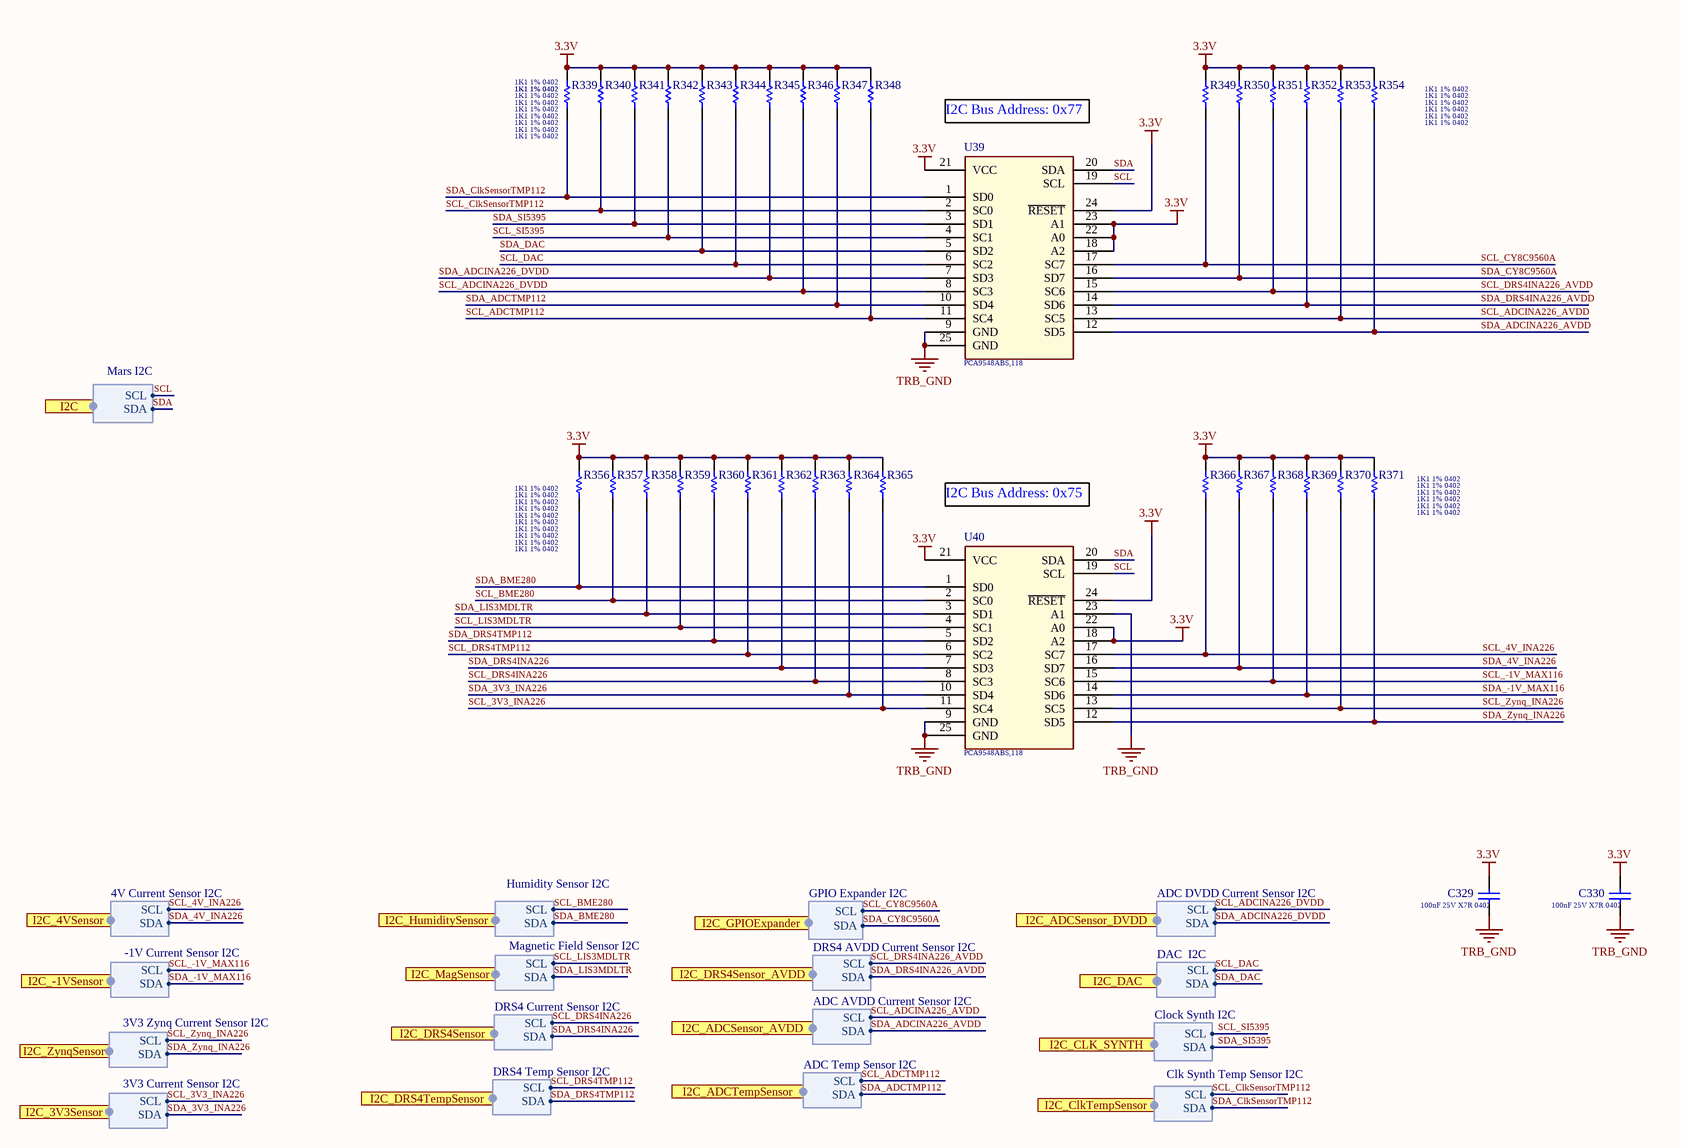
[diagram p30: I2C_MULTIPLEX.SchDoc]

### Parts
C329  Capacitance: 100nF 25V X7R 0402  [Cap_Taiyo_Yuden_TMK105B7104KV-FR_100nF]  (hidden comment: Cap_Taiyo_Yuden_TMK105B7104KV-FR_100nF)
C330  Capacitance: 100nF 25V X7R 0402  [Cap_Taiyo_Yuden_TMK105B7104KV-FR_100nF]  (hidden comment: Cap_Taiyo_Yuden_TMK105B7104KV-FR_100nF)
R339  1K1 1% 0402  [RESC0402(1005)_L]
R340  1K1 1% 0402  [RESC0402(1005)_L]
R341  1K1 1% 0402  [RESC0402(1005)_L]
R342  1K1 1% 0402  [RESC0402(1005)_L]
R343  1K1 1% 0402  [RESC0402(1005)_L]
R344  1K1 1% 0402  [RESC0402(1005)_L]
R345  1K1 1% 0402  [RESC0402(1005)_L]
R346  1K1 1% 0402  [RESC0402(1005)_L]
R347  1K1 1% 0402  [RESC0402(1005)_L]
R348  1K1 1% 0402  [RESC0402(1005)_L]
R349  1K1 1% 0402  [RESC0402(1005)_L]
R350  1K1 1% 0402  [RESC0402(1005)_L]
R351  1K1 1% 0402  [RESC0402(1005)_L]
R352  1K1 1% 0402  [RESC0402(1005)_L]
R353  1K1 1% 0402  [RESC0402(1005)_L]
R354  1K1 1% 0402  [RESC0402(1005)_L]
R356  1K1 1% 0402  [RESC0402(1005)_L]
R357  1K1 1% 0402  [RESC0402(1005)_L]
R358  1K1 1% 0402  [RESC0402(1005)_L]
R359  1K1 1% 0402  [RESC0402(1005)_L]
R360  1K1 1% 0402  [RESC0402(1005)_L]
R361  1K1 1% 0402  [RESC0402(1005)_L]
R362  1K1 1% 0402  [RESC0402(1005)_L]
R363  1K1 1% 0402  [RESC0402(1005)_L]
R364  1K1 1% 0402  [RESC0402(1005)_L]
R365  1K1 1% 0402  [RESC0402(1005)_L]
R366  1K1 1% 0402  [RESC0402(1005)_L]
R367  1K1 1% 0402  [RESC0402(1005)_L]
R368  1K1 1% 0402  [RESC0402(1005)_L]
R369  1K1 1% 0402  [RESC0402(1005)_L]
R370  1K1 1% 0402  [RESC0402(1005)_L]
R371  1K1 1% 0402  [RESC0402(1005)_L]
U39  Series: PCA9548ABS,118  [IC_NXP_PCA9548ABS,118_I2C_8Channel]  (hidden comment: IC_NXP_PCA9548ABS,118_I2C_8Channel)
U40  Series: PCA9548ABS,118  [IC_NXP_PCA9548ABS,118_I2C_8Channel]  (hidden comment: IC_NXP_PCA9548ABS,118_I2C_8Channel)

### Ports
I2C (harness Mars I2C), I2C_3V3Sensor (harness 3V3 Current Sensor I2C), I2C_4VSensor (harness 4V Current Sensor I2C), I2C_-1VSensor (harness -1V Current Sensor I2C), I2C_ADCSensor_AVDD (harness ADC AVDD Current Sensor I2C), I2C_ADCSensor_DVDD (harness ADC DVDD Current Sensor I2C), I2C_ADCTempSensor (harness ADC Temp Sensor I2C), I2C_CLK_SYNTH (harness Clock Synth I2C), I2C_ClkTempSensor (harness Clk Synth Temp Sensor I2C), I2C_DAC (harness DAC  I2C), I2C_DRS4Sensor (harness DRS4 Current Sensor I2C), I2C_DRS4Sensor_AVDD (harness DRS4 AVDD Current Sensor I2C), I2C_DRS4TempSensor (harness DRS4 Temp Sensor I2C), I2C_GPIOExpander (harness GPIO Expander I2C), I2C_HumiditySensor (harness Humidity Sensor I2C), I2C_MagSensor (harness Magnetic Field Sensor I2C), I2C_ZynqSensor (harness 3V3 Zynq Current Sensor I2C)

### Harnesses
Mars I2C: SCL, SDA
4V Current Sensor I2C: SCL, SDA
-1V Current Sensor I2C: SCL, SDA
3V3 Zynq Current Sensor I2C: SCL, SDA
3V3 Current Sensor I2C: SCL, SDA
Humidity Sensor I2C: SCL, SDA
Magnetic Field Sensor I2C: SCL, SDA
DRS4 Temp Sensor I2C: SCL, SDA
DRS4 Current Sensor I2C: SCL, SDA
DRS4 AVDD Current Sensor I2C: SCL, SDA
GPIO Expander I2C: SCL, SDA
ADC AVDD Current Sensor I2C: SCL, SDA
ADC Temp Sensor I2C: SCL, SDA
ADC DVDD Current Sensor I2C: SCL, SDA
DAC  I2C: SCL, SDA
Clock Synth I2C: SCL, SDA
Clk Synth Temp Sensor I2C: SCL, SDA

### Nets
3.3V: C329.2 C330.2 R339.2 R340.2 R341.2 R342.2 R343.2 R344.2 R345.2 R346.2 R347.2 R348.2 R349.2 R350.2 R351.2 R352.2 R353.2 R354.2 R356.2 R357.2 R358.2 R359.2 R360.2 R361.2 R362.2 R363.2 R364.2 R365.2 R366.2 R367.2 R368.2 R369.2 R370.2 R371.2 U39.18(A2) U39.21(VCC) U39.22(A0) U39.23(A1) U39.24(~{RESET}) U40.18(A2) U40.21(VCC) U40.22(A0) U40.24(~{RESET})
TRB_GND: C329.1 C330.1 U39.9(GND) U39.25(GND) U40.9(GND) U40.23(A1) U40.25(GND)
SCL: U39.19(SCL) U40.19(SCL) ; port I2C.SCL
SCL_3V3_INA226: R365.1 U40.11(SC4) ; port I2C_3V3Sensor.SCL
SCL_4V_INA226: R366.1 U40.17(SC7) ; port I2C_4VSensor.SCL
SCL_-1V_MAX116: R368.1 U40.15(SC6) ; port I2C_-1VSensor.SCL
SCL_ADCINA226_AVDD: R353.1 U39.13(SC5) ; port I2C_ADCSensor_AVDD.SCL
SCL_ADCINA226_DVDD: R346.1 U39.8(SC3) ; port I2C_ADCSensor_DVDD.SCL
SCL_ADCTMP112: R348.1 U39.11(SC4) ; port I2C_ADCTempSensor.SCL
SCL_BME280: R357.1 U40.2(SC0) ; port I2C_HumiditySensor.SCL
SCL_ClkSensorTMP112: R340.1 U39.2(SC0) ; port I2C_ClkTempSensor.SCL
SCL_CY8C9560A: R349.1 U39.17(SC7) ; port I2C_GPIOExpander.SCL
SCL_DAC: R344.1 U39.6(SC2) ; port I2C_DAC.SCL
SCL_DRS4INA226: R363.1 U40.8(SC3) ; port I2C_DRS4Sensor.SCL
SCL_DRS4INA226_AVDD: R351.1 U39.15(SC6) ; port I2C_DRS4Sensor_AVDD.SCL
SCL_DRS4TMP112: R361.1 U40.6(SC2) ; port I2C_DRS4TempSensor.SCL
SCL_LIS3MDLTR: R359.1 U40.4(SC1) ; port I2C_MagSensor.SCL
SCL_SI5395: R342.1 U39.4(SC1) ; port I2C_CLK_SYNTH.SCL
SCL_Zynq_INA226: R370.1 U40.13(SC5) ; port I2C_ZynqSensor.SCL
SDA: U39.20(SDA) U40.20(SDA) ; port I2C.SDA
SDA_3V3_INA226: R364.1 U40.10(SD4) ; port I2C_3V3Sensor.SDA
SDA_4V_INA226: R367.1 U40.16(SD7) ; port I2C_4VSensor.SDA
SDA_-1V_MAX116: R369.1 U40.14(SD6) ; port I2C_-1VSensor.SDA
SDA_ADCINA226_AVDD: R354.1 U39.12(SD5) ; port I2C_ADCSensor_AVDD.SDA
SDA_ADCINA226_DVDD: R345.1 U39.7(SD3) ; port I2C_ADCSensor_DVDD.SDA
SDA_ADCTMP112: R347.1 U39.10(SD4) ; port I2C_ADCTempSensor.SDA
SDA_BME280: R356.1 U40.1(SD0) ; port I2C_HumiditySensor.SDA
SDA_ClkSensorTMP112: R339.1 U39.1(SD0) ; port I2C_ClkTempSensor.SDA
SDA_CY8C9560A: R350.1 U39.16(SD7) ; port I2C_GPIOExpander.SDA
SDA_DAC: R343.1 U39.5(SD2) ; port I2C_DAC.SDA
SDA_DRS4INA226: R362.1 U40.7(SD3) ; port I2C_DRS4Sensor.SDA
SDA_DRS4INA226_AVDD: R352.1 U39.14(SD6) ; port I2C_DRS4Sensor_AVDD.SDA
SDA_DRS4TMP112: R360.1 U40.5(SD2) ; port I2C_DRS4TempSensor.SDA
SDA_LIS3MDLTR: R358.1 U40.3(SD1) ; port I2C_MagSensor.SDA
SDA_SI5395: R341.1 U39.3(SD1) ; port I2C_CLK_SYNTH.SDA
SDA_Zynq_INA226: R371.1 U40.12(SD5) ; port I2C_ZynqSensor.SDA

### Notes on the sheet
- I2C Bus Address: 0x77
- I2C Bus Address: 0x75
- 475 Portola Plaza
- GAPS TOF
- igarcia91@g.ucla.edu
- Los Angeles, CA
- 310-825-0344
- Size:
- Date:
- Letter
- Revision:
- Time:
- Sheet
- of
- andrew.peck@cern.ch
- spq@ucla.edu
- File:

### Library data of the parts
C329 C330 = Cap_Taiyo_Yuden_TMK105B7104KV-FR_100nF: CAP CER 100nF 25V X7R 0402; Supplier 1: Mouser; Supplier Part Number 1: 963-TMK105B7104KV-FR
R339-R354 R356-R371 = CMP-1011-00514-1: 1K1 0.063W 1% 0402 (1005 Metric)  SMD; Case-Metric: 1005; Case-EIA: 0402; Value: 1100.00 Ohm; Power: 0.063 W; Tolerance: 1 %; Technology: SMT
U39 U40 = IC_NXP_PCA9548ABS,118_I2C_8Channel: Multiplexer Switch ICs 8CH I2C SWTCH W/REST; Supplier Part Number 1: 771-PCA9548ABS118; Supplier 1: Mouser

## Sheet 1V8_SUPPLY.SchDoc: My title
size A3; Organization: University of California; Address1: 475 Portola Plaza; Address2: Los Angeles, CA 90095; DocumentNumber: 10; Revision: R01; SheetNumber: 10; SheetTotal: 35
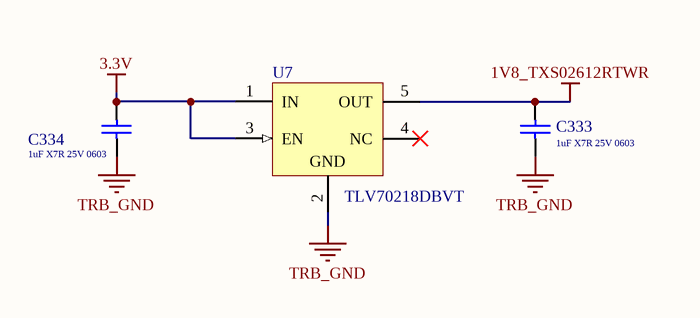
[diagram p31: 1V8_SUPPLY.SchDoc]

### Parts
C333  Capacitance: 1uF X7R 25V 0603  [Cap_Murata_GCJ188R71E105KA01J_1uF]  (hidden comment: Cap_Murata_GCJ188R71E105KA01J_1uF)
C334  Capacitance: 1uF X7R 25V 0603  [Cap_Murata_GCJ188R71E105KA01J_1uF]  (hidden comment: Cap_Murata_GCJ188R71E105KA01J_1uF)
U7  TLV70218DBVT  [TI-DBV5_N]

### Nets
1V8_TXS02612RTWR: C333.2 U7.5(OUT)
3.3V: C334.2 U7.1(IN) U7.3(EN)
TRB_GND: C333.1 C334.1 U7.2(GND)

Not connected (* = marked no-connect by the designer): U7 4(NC)*

### Notes on the sheet
- 475 Portola Plaza
- GAPS TOF
- igarcia91@g.ucla.edu
- Los Angeles, CA
- 310-825-0344
- Size:
- Date:
- Letter
- Revision:
- Time:
- Sheet
- of
- andrew.peck@cern.ch
- spq@ucla.edu
- File:

### Library data of the parts
C333 C334 = Cap_Murata_GCJ188R71E105KA01J_1uF: CAP CER 1uF 25V X7R 0603; Supplier 1: Mouser; Supplier Part Number 1: 81-GCJ188R71E105KA1J
U7 = TLV70218DBVT: Single Output LDO, 300 mA, Fixed 1.8 V Output, 2 to 5.5 V Input, with Low IQ, 5-pin SOT-23 (DBV), -40 to 125 degC, Green (RoHS & no Sb/Br); Manufacturer: Texas Instruments; Accuracy(%): 2; Iq(Typ)(mA): 0.03; Vout Adj(Min)(V): 1.8; SubFamily: Single Channel LDO; Vin(Max)(V): 5.5; Iout(Max)(A): 0.3; Vdo(Typ)(mV): 220; Vin(Min)(V): 2; Eco-Plan: Green (RoHS & no Sb/Br); PartNumber: TLV70218DBVT; ComponentLink1Description: Manufacturer URL; ComponentLink2Description: Datasheet; DatasheetVersion: SLVSAG6B; ComponentLink3URL: http://www.ti.com/litv/pdf/mpds018i; Vout Adj(Max)(V): 1.8; ComponentLink1URL: http://www.ti.com/; Fixed Output Options(V): 1.8; Code_JEDEC: MO-178; ComponentLink2URL: http://www.ti.com/general/docs/lit/getliterature.tsp?genericPartNumber=TLV70218&fileType=pdf; ComponentLink3Description: Package Specification; PackageVersion: 4073253-4/K; Mounting Technology: Surface Mount; PackageReference: DBV5; PackageDescription: 5-Pin Plastic Small Outline, Body 1.60 Ãƒâ€” 2.90 mm, Pitch 0.95 mm

## Sheet COVER.SchDoc: My title
size A3; Organization: University of California; Address1: 475 Portola Plaza; Address2: Los Angeles, CA 90095; DocumentNumber: 1; Revision: R01; SheetNumber: 1; SheetTotal: 35
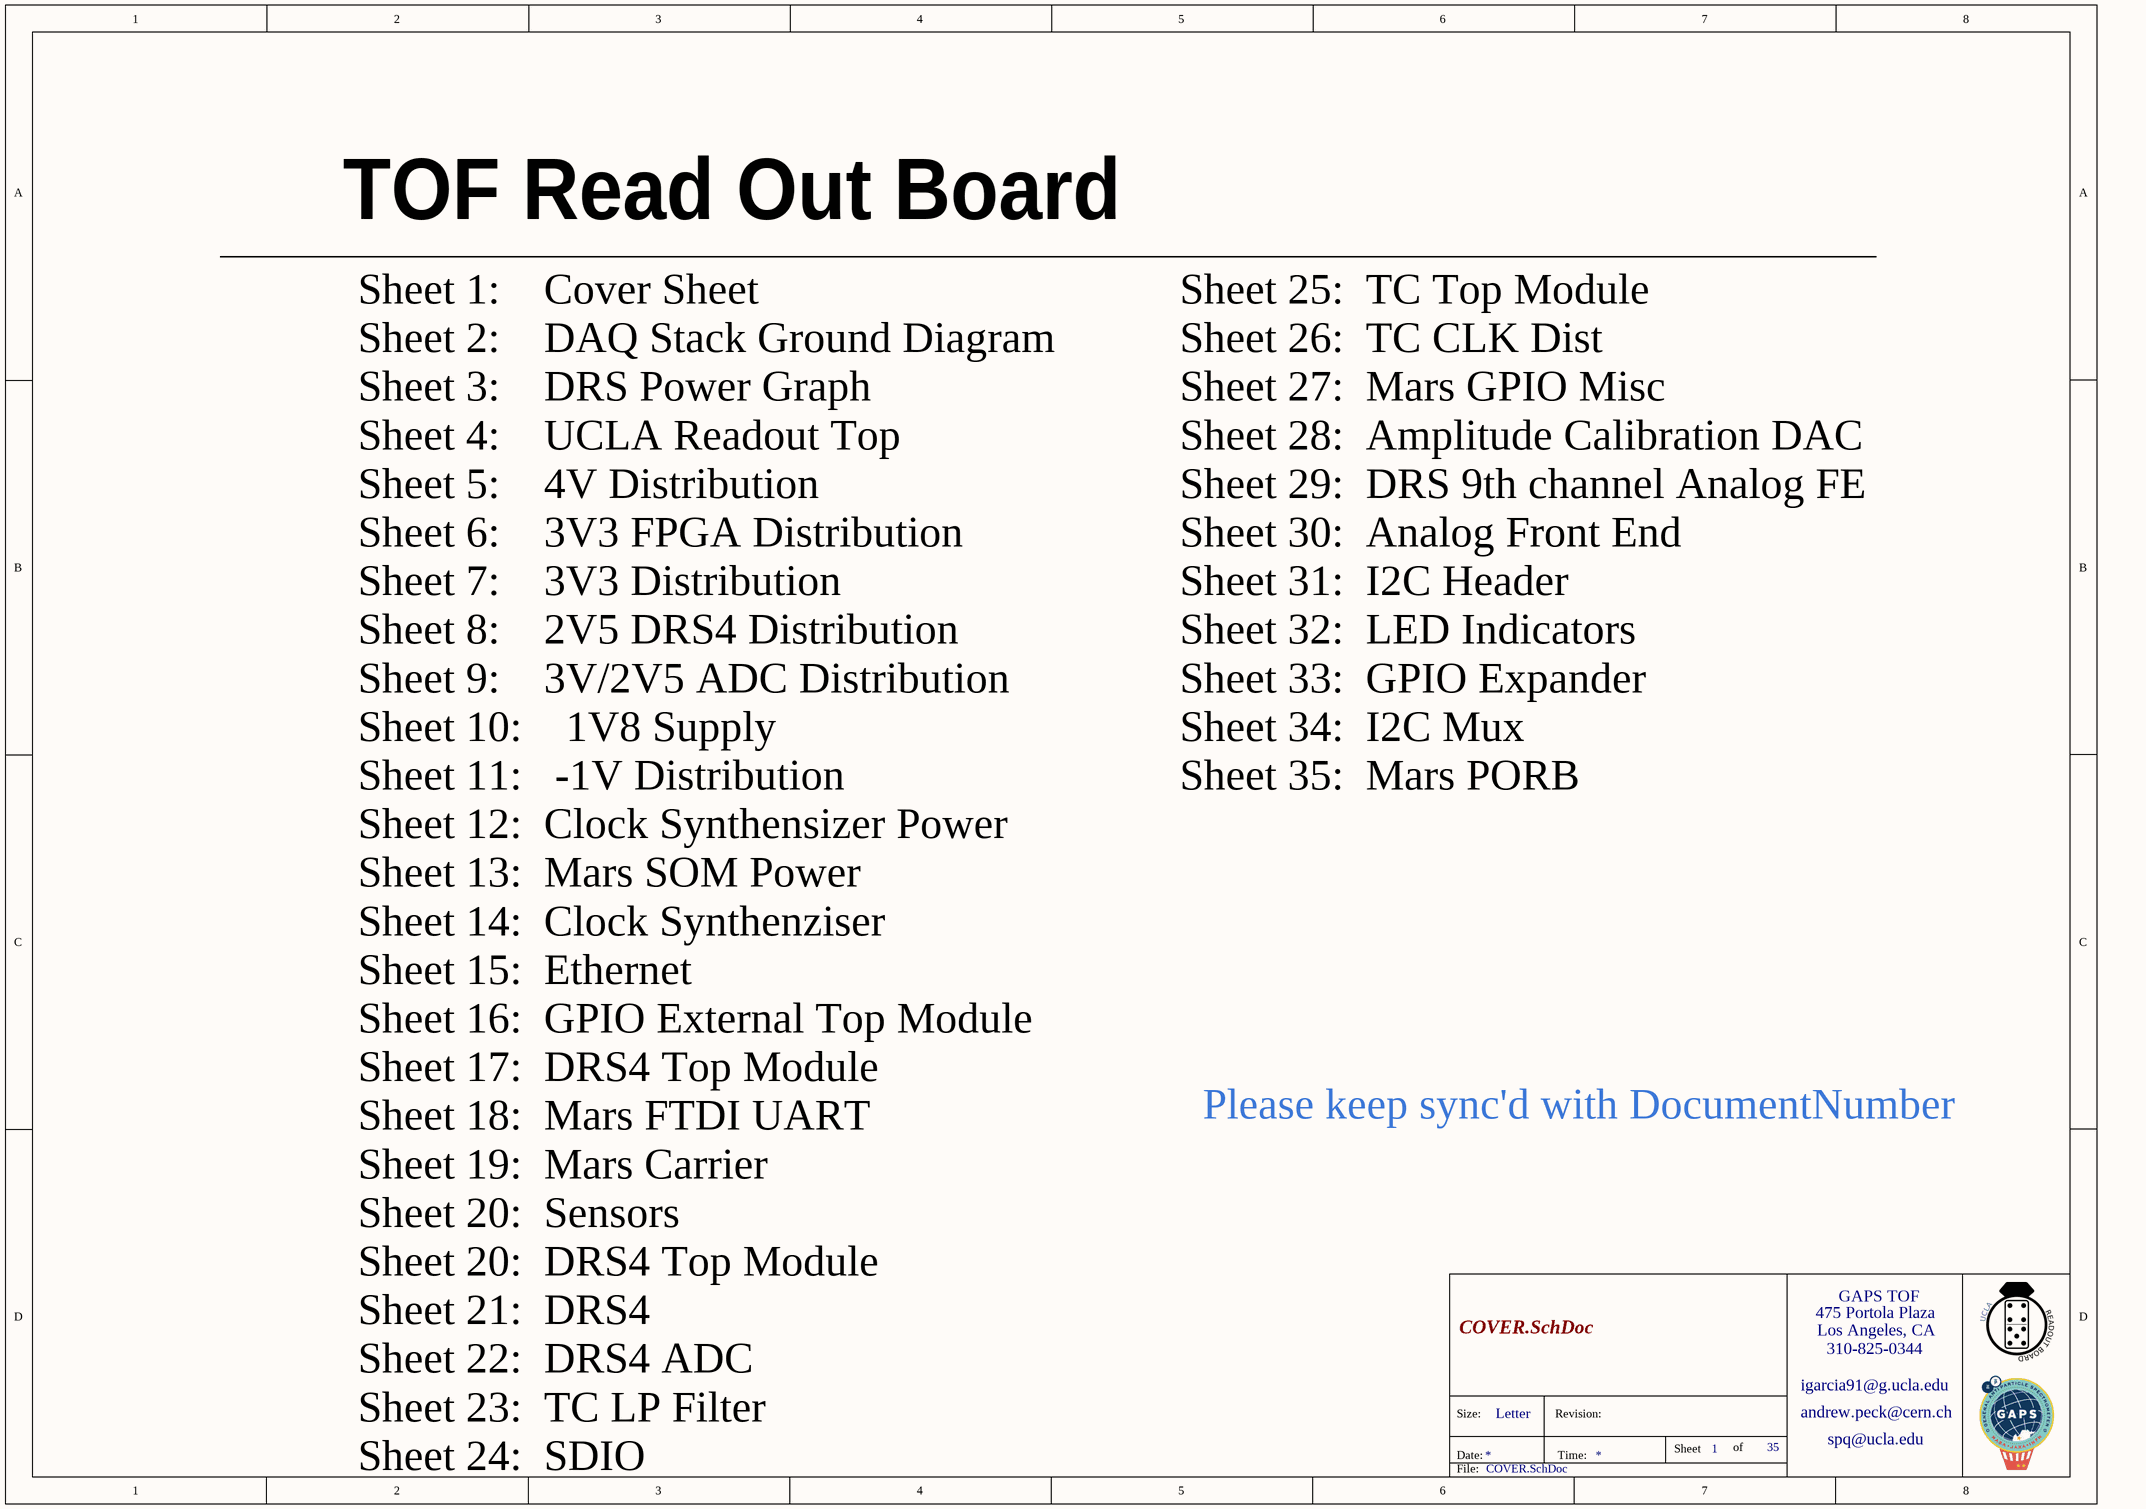
[diagram p32: COVER.SchDoc]

### Notes on the sheet
- TOF Read Out Board
- Sheet 25:  TC Top Module
  Sheet 26:  TC CLK Dist
  Sheet 27:  Mars GPIO Misc
  Sheet 28:  Amplitude Calibration DAC
  Sheet 29:  DRS 9th channel Analog FE
  Sheet 30:  Analog Front End
  Sheet 31:  I2C Header
  Sheet 32:  LED Indicators
  Sheet 33:  GPIO Expander
  Sheet 34:  I2C Mux
  Sheet 35:  Mars PORB
- Please keep sync'd with DocumentNumber
- Sheet 1:    Cover Sheet
  Sheet 2:    DAQ Stack Ground Diagram
  Sheet 3:    DRS Power Graph
  Sheet 4:    UCLA Readout Top
  Sheet 5:    4V Distribution
  Sheet 6:    3V3 FPGA Distribution
  Sheet 7:    3V3 Distribution
  Sheet 8:    2V5 DRS4 Distribution
  Sheet 9:    3V/2V5 ADC Distribution
  Sheet 10:    1V8 Supply
  Sheet 11:   -1V Distribution
  Sheet 12:  Clock Synthensizer Power
  Sheet 13:  Mars SOM Power
  Sheet 14:  Clock Synthenziser
  Sheet 15:  Ethernet
  Sheet 16:  GPIO External Top Module
  Sheet 17:  DRS4 Top Module
  Sheet 18:  Mars FTDI UART
  Sheet 19:  Mars Carrier
  Sheet 20:  Sensors
  Sheet 20:  DRS4 Top Module
  Sheet 21:  DRS4
  Sheet 22:  DRS4 ADC
  Sheet 23:  TC LP Filter
  Sheet 24:  SDIO
- 475 Portola Plaza
- GAPS TOF
- igarcia91@g.ucla.edu
- Los Angeles, CA
- 310-825-0344
- Size:
- Date:
- Letter
- Revision:
- Time:
- Sheet
- of
- andrew.peck@cern.ch
- spq@ucla.edu
- File:

## Sheet TOF_GND_SCHEME.SchDoc: My title
size A3; Organization: University of California; Address1: 475 Portola Plaza; Address2: Los Angeles, CA 90095; DocumentNumber: 2; Revision: R01; SheetNumber: 2; SheetTotal: 35
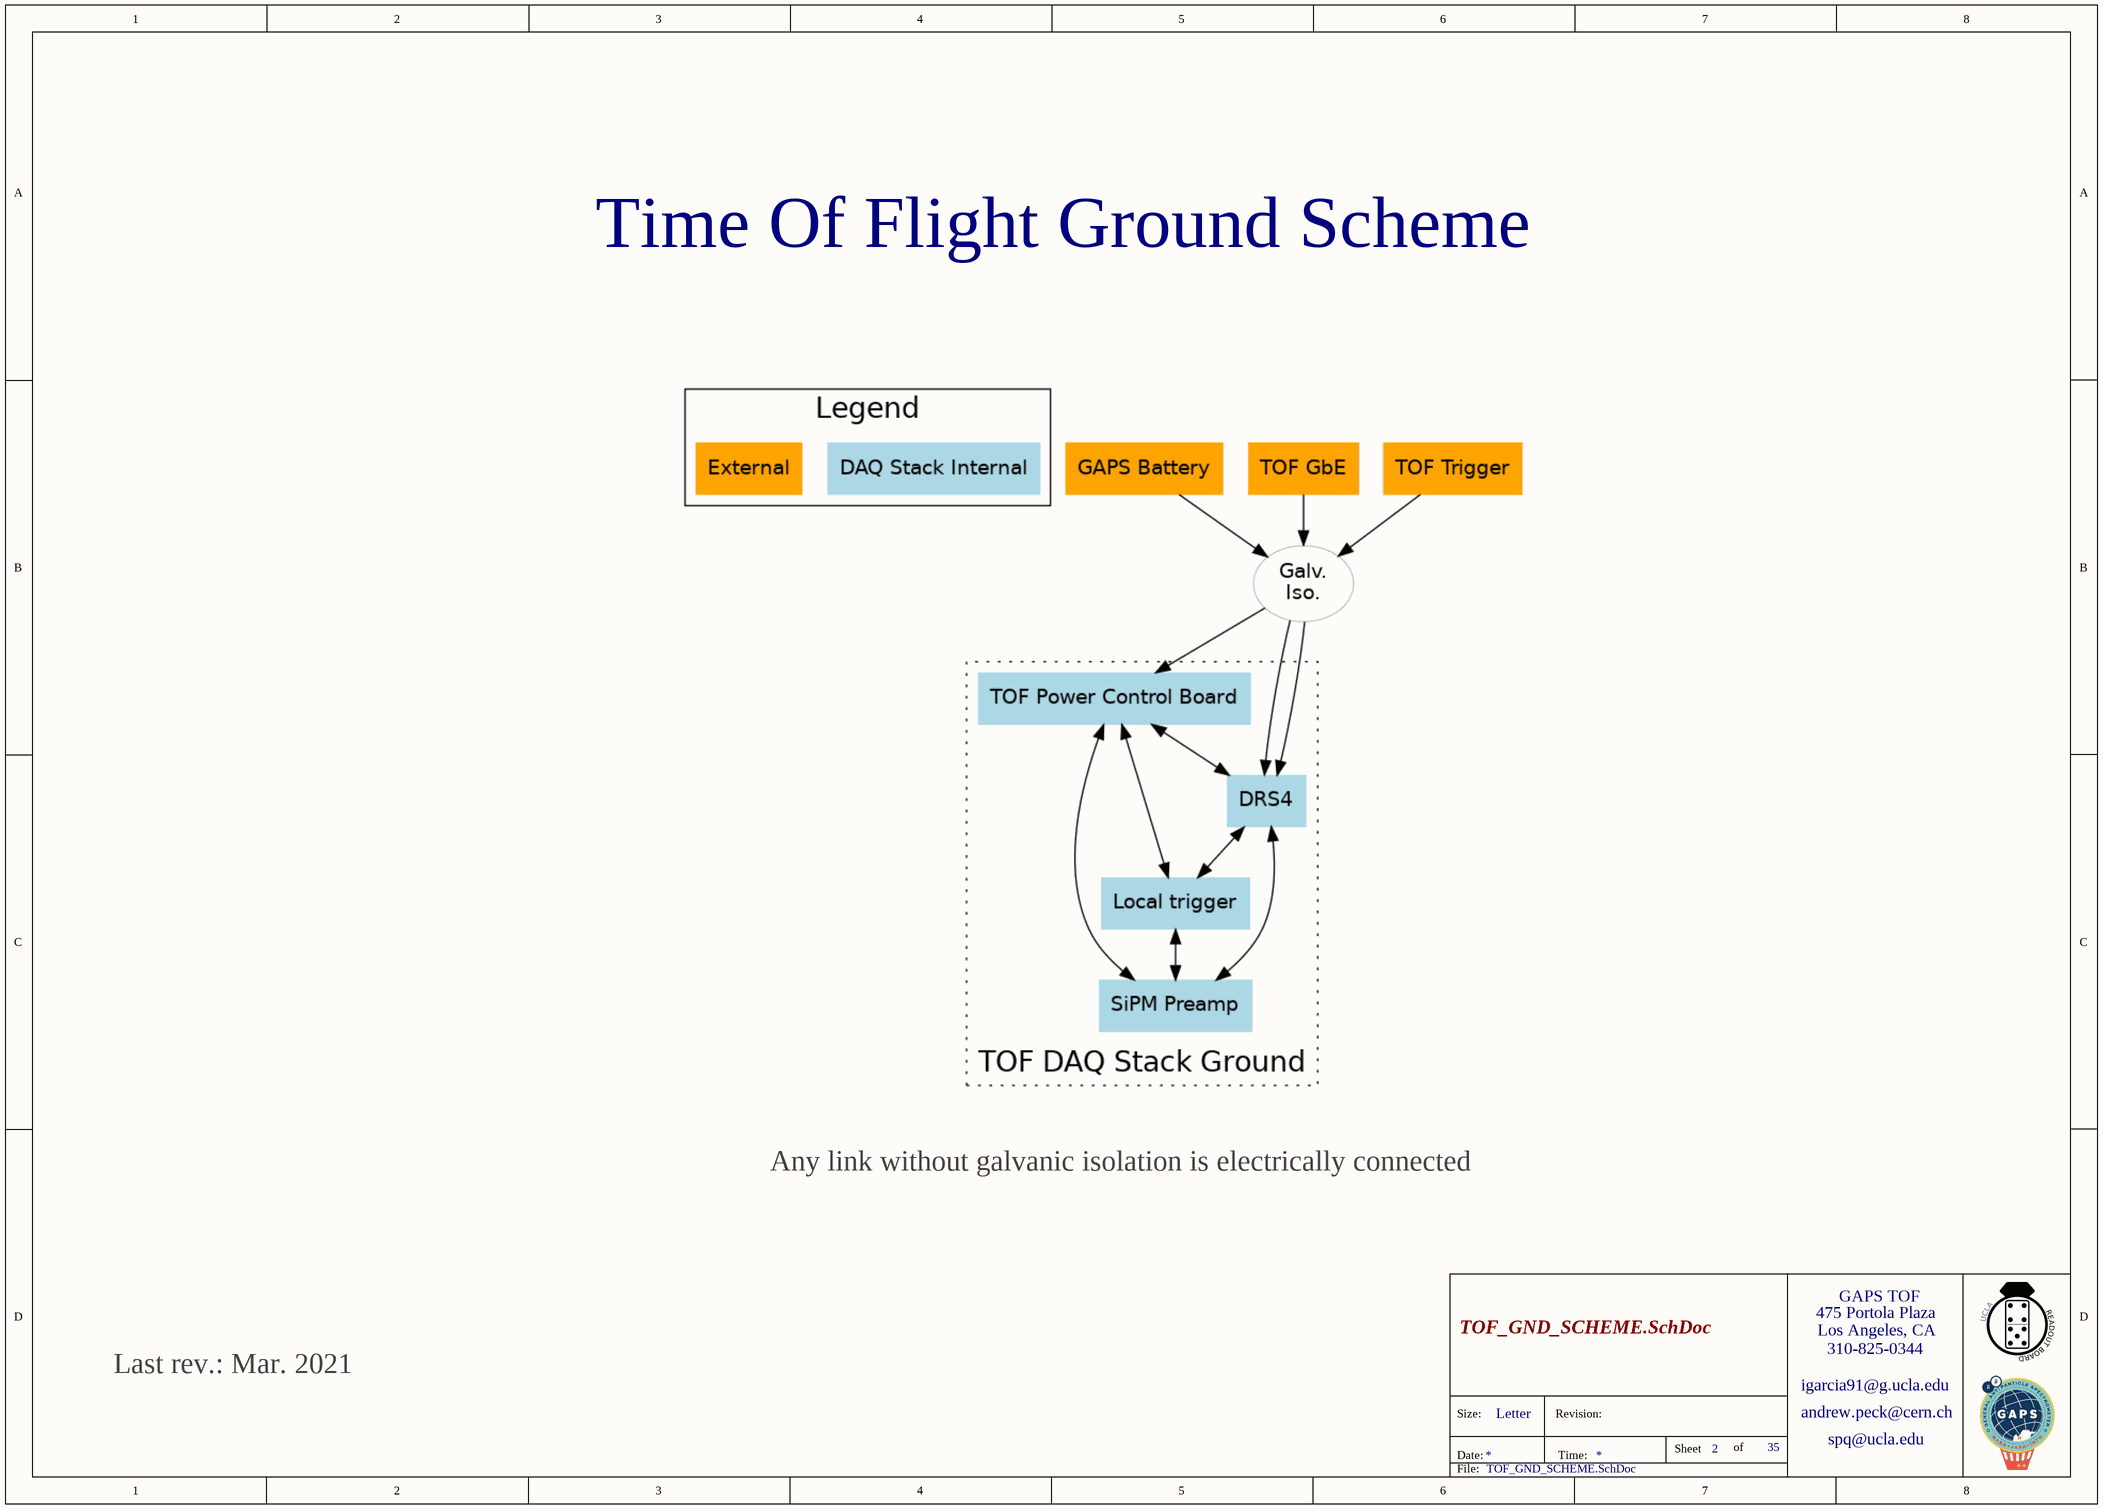
[diagram p33: TOF_GND_SCHEME.SchDoc]

### Notes on the sheet
- Time Of Flight Ground Scheme
- Any link without galvanic isolation is electrically connected
- Last rev.: Mar. 2021
- 475 Portola Plaza
- GAPS TOF
- igarcia91@g.ucla.edu
- Los Angeles, CA
- 310-825-0344
- Size:
- Date:
- Letter
- Revision:
- Time:
- Sheet
- of
- andrew.peck@cern.ch
- spq@ucla.edu
- File:

## Sheet DRS_POWER_GRAPH.SchDoc: My title
size A3; Organization: University of California; Address1: 475 Portola Plaza; Address2: Los Angeles, CA 90095; DocumentNumber: 3; Revision: R01; SheetNumber: 3; SheetTotal: 35
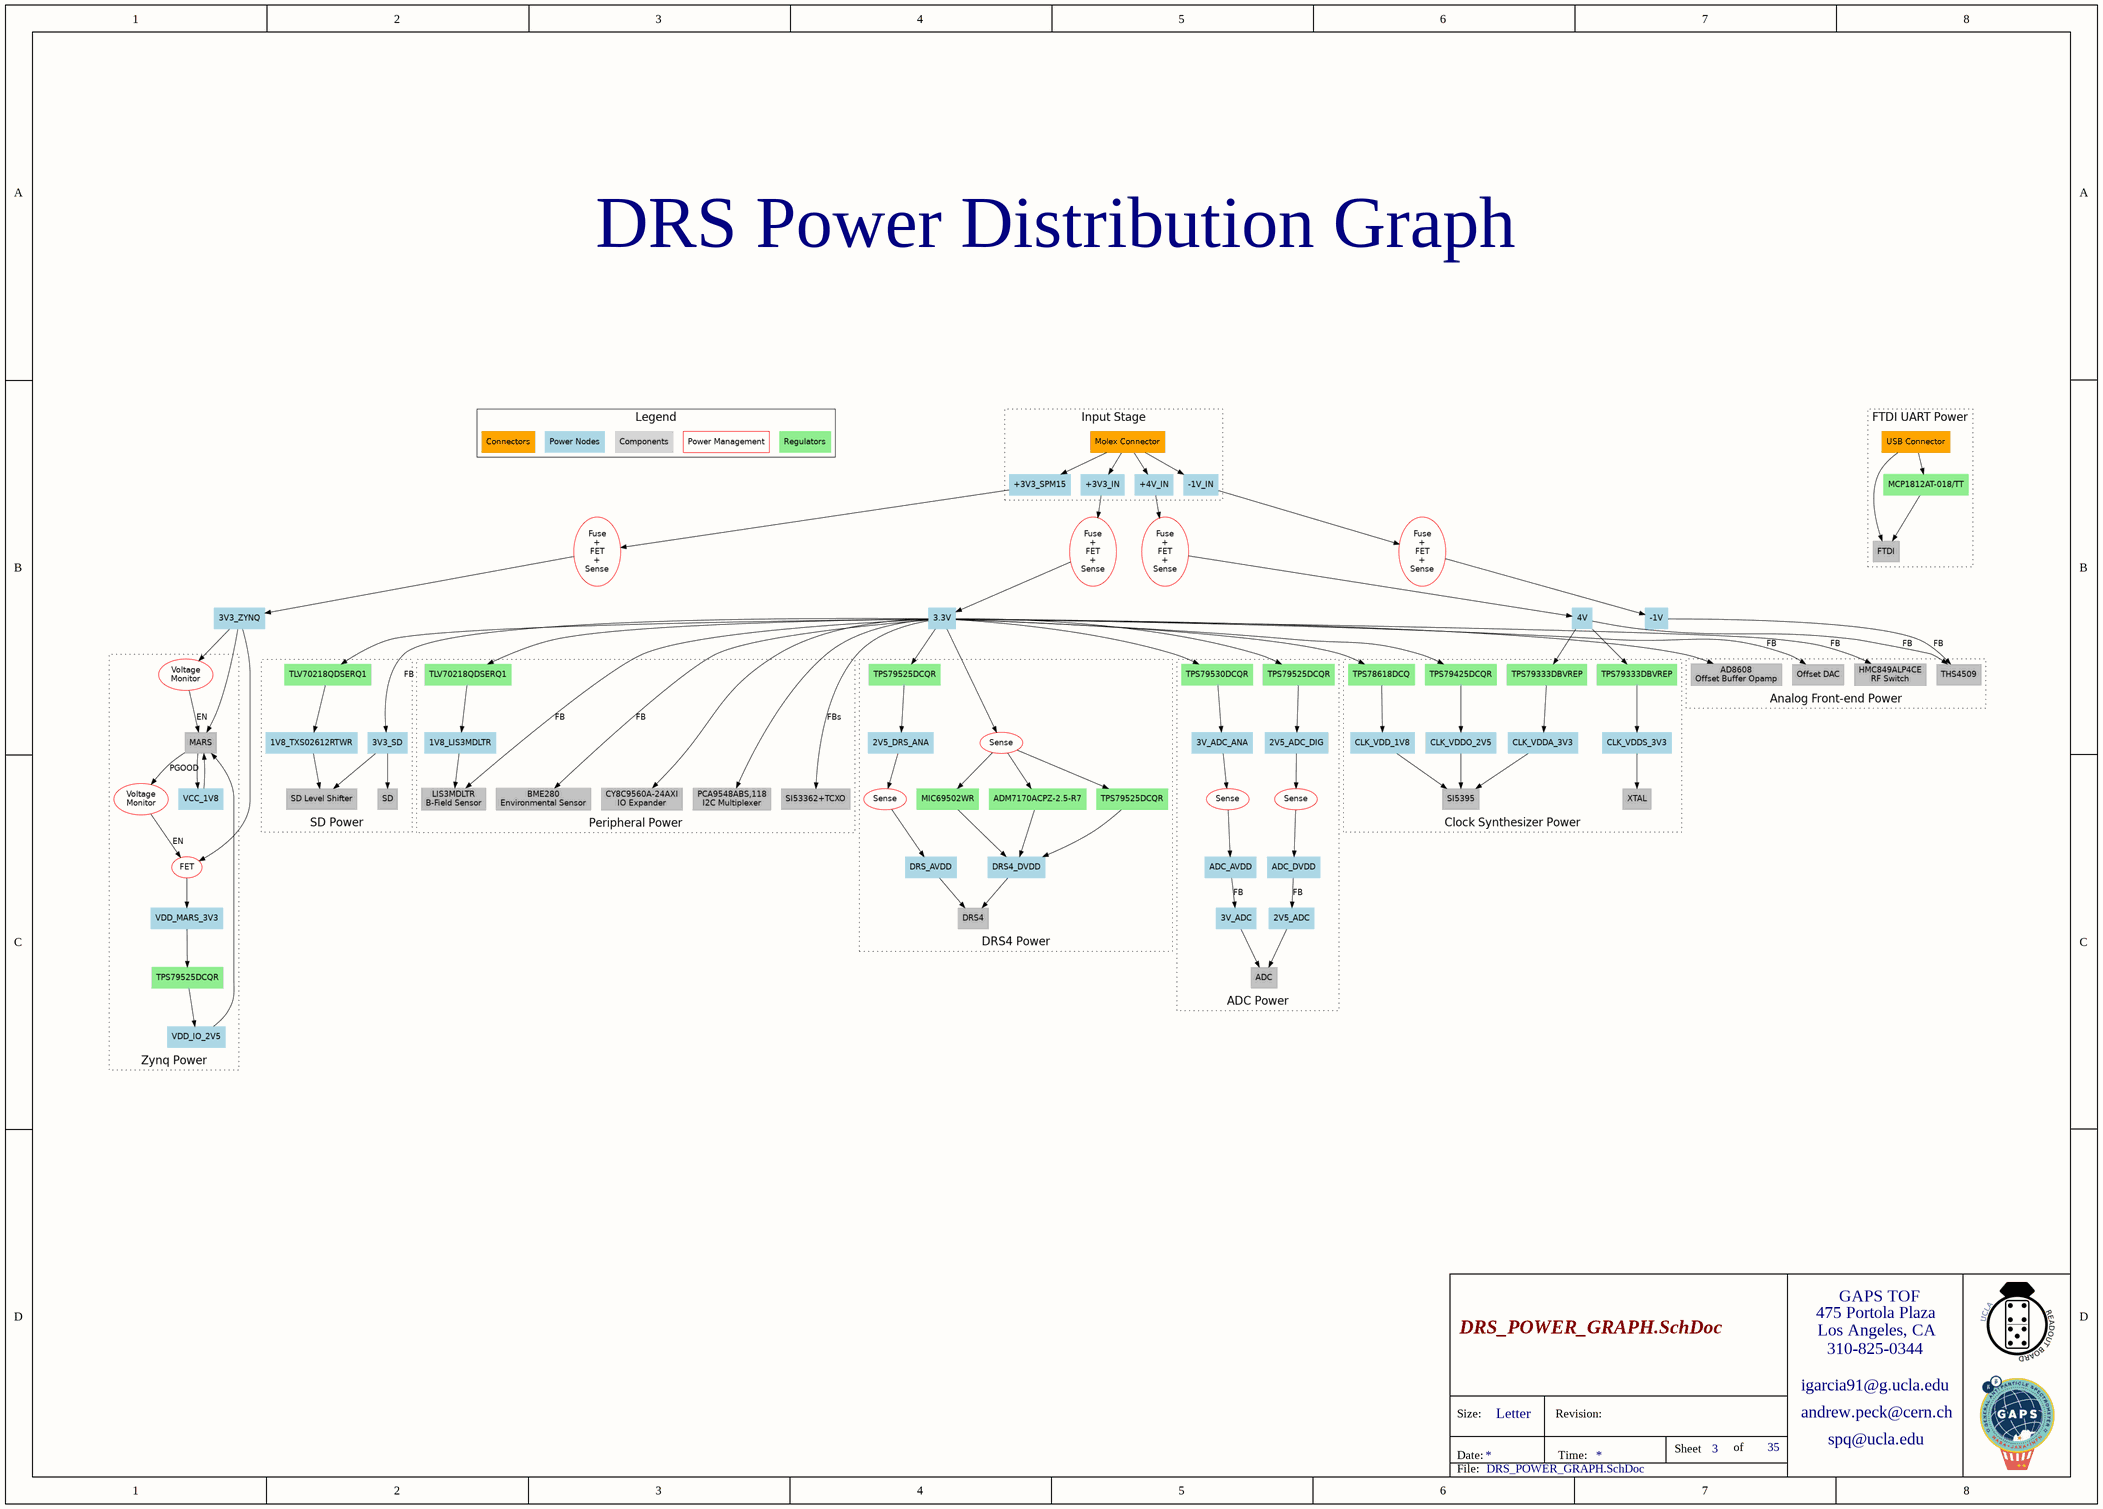
[diagram p34: DRS_POWER_GRAPH.SchDoc]

### Notes on the sheet
- DRS Power Distribution Graph
- 475 Portola Plaza
- GAPS TOF
- igarcia91@g.ucla.edu
- Los Angeles, CA
- 310-825-0344
- Size:
- Date:
- Letter
- Revision:
- Time:
- Sheet
- of
- andrew.peck@cern.ch
- spq@ucla.edu
- File: